# EasyEDA schematic schematics_easyEDA.json

## Sheets
1 BLOCK DIAGRAM: TITLE: BLOCK DIAGRAM; REV: 1.0; Date: 2023-02-03; Sheet: 1/7; Drawn By: hammad safeer; Company: FERN (BMS)
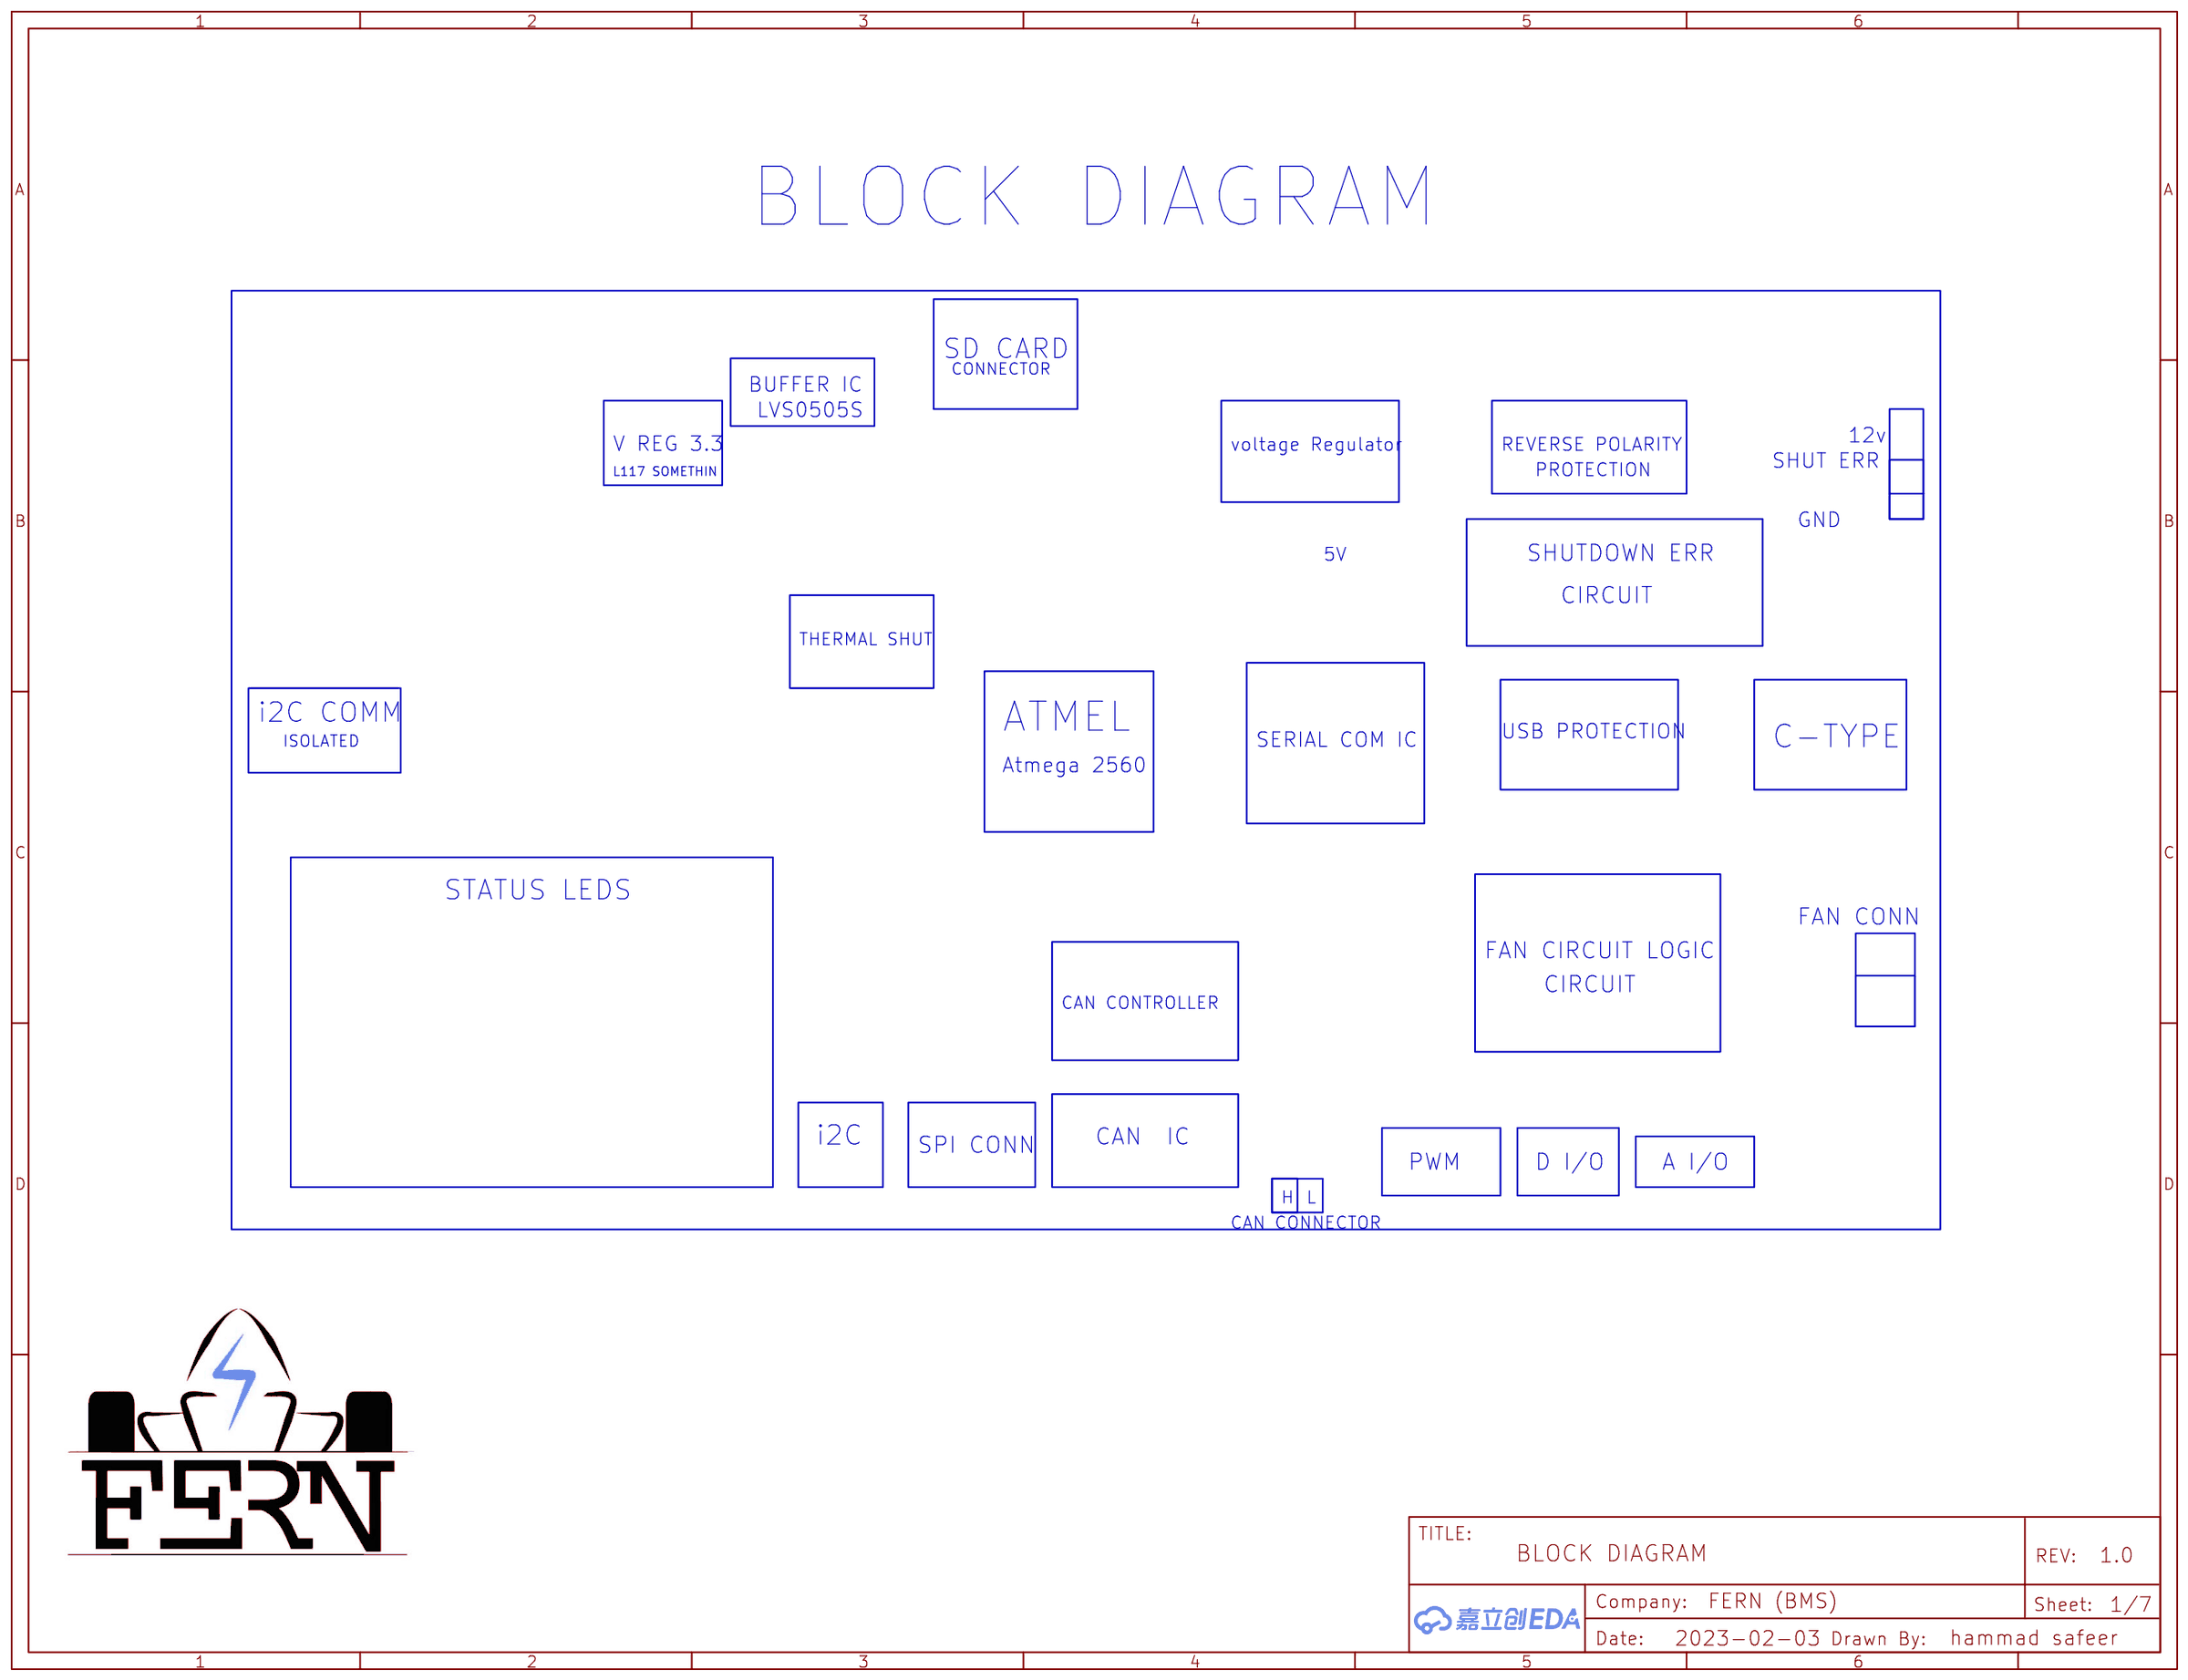
[diagram p0: BLOCK DIAGRAM]
2 main microcontroler: TITLE: atmega2560 section + CONENCTORS; Company: FERN BMS MASTER
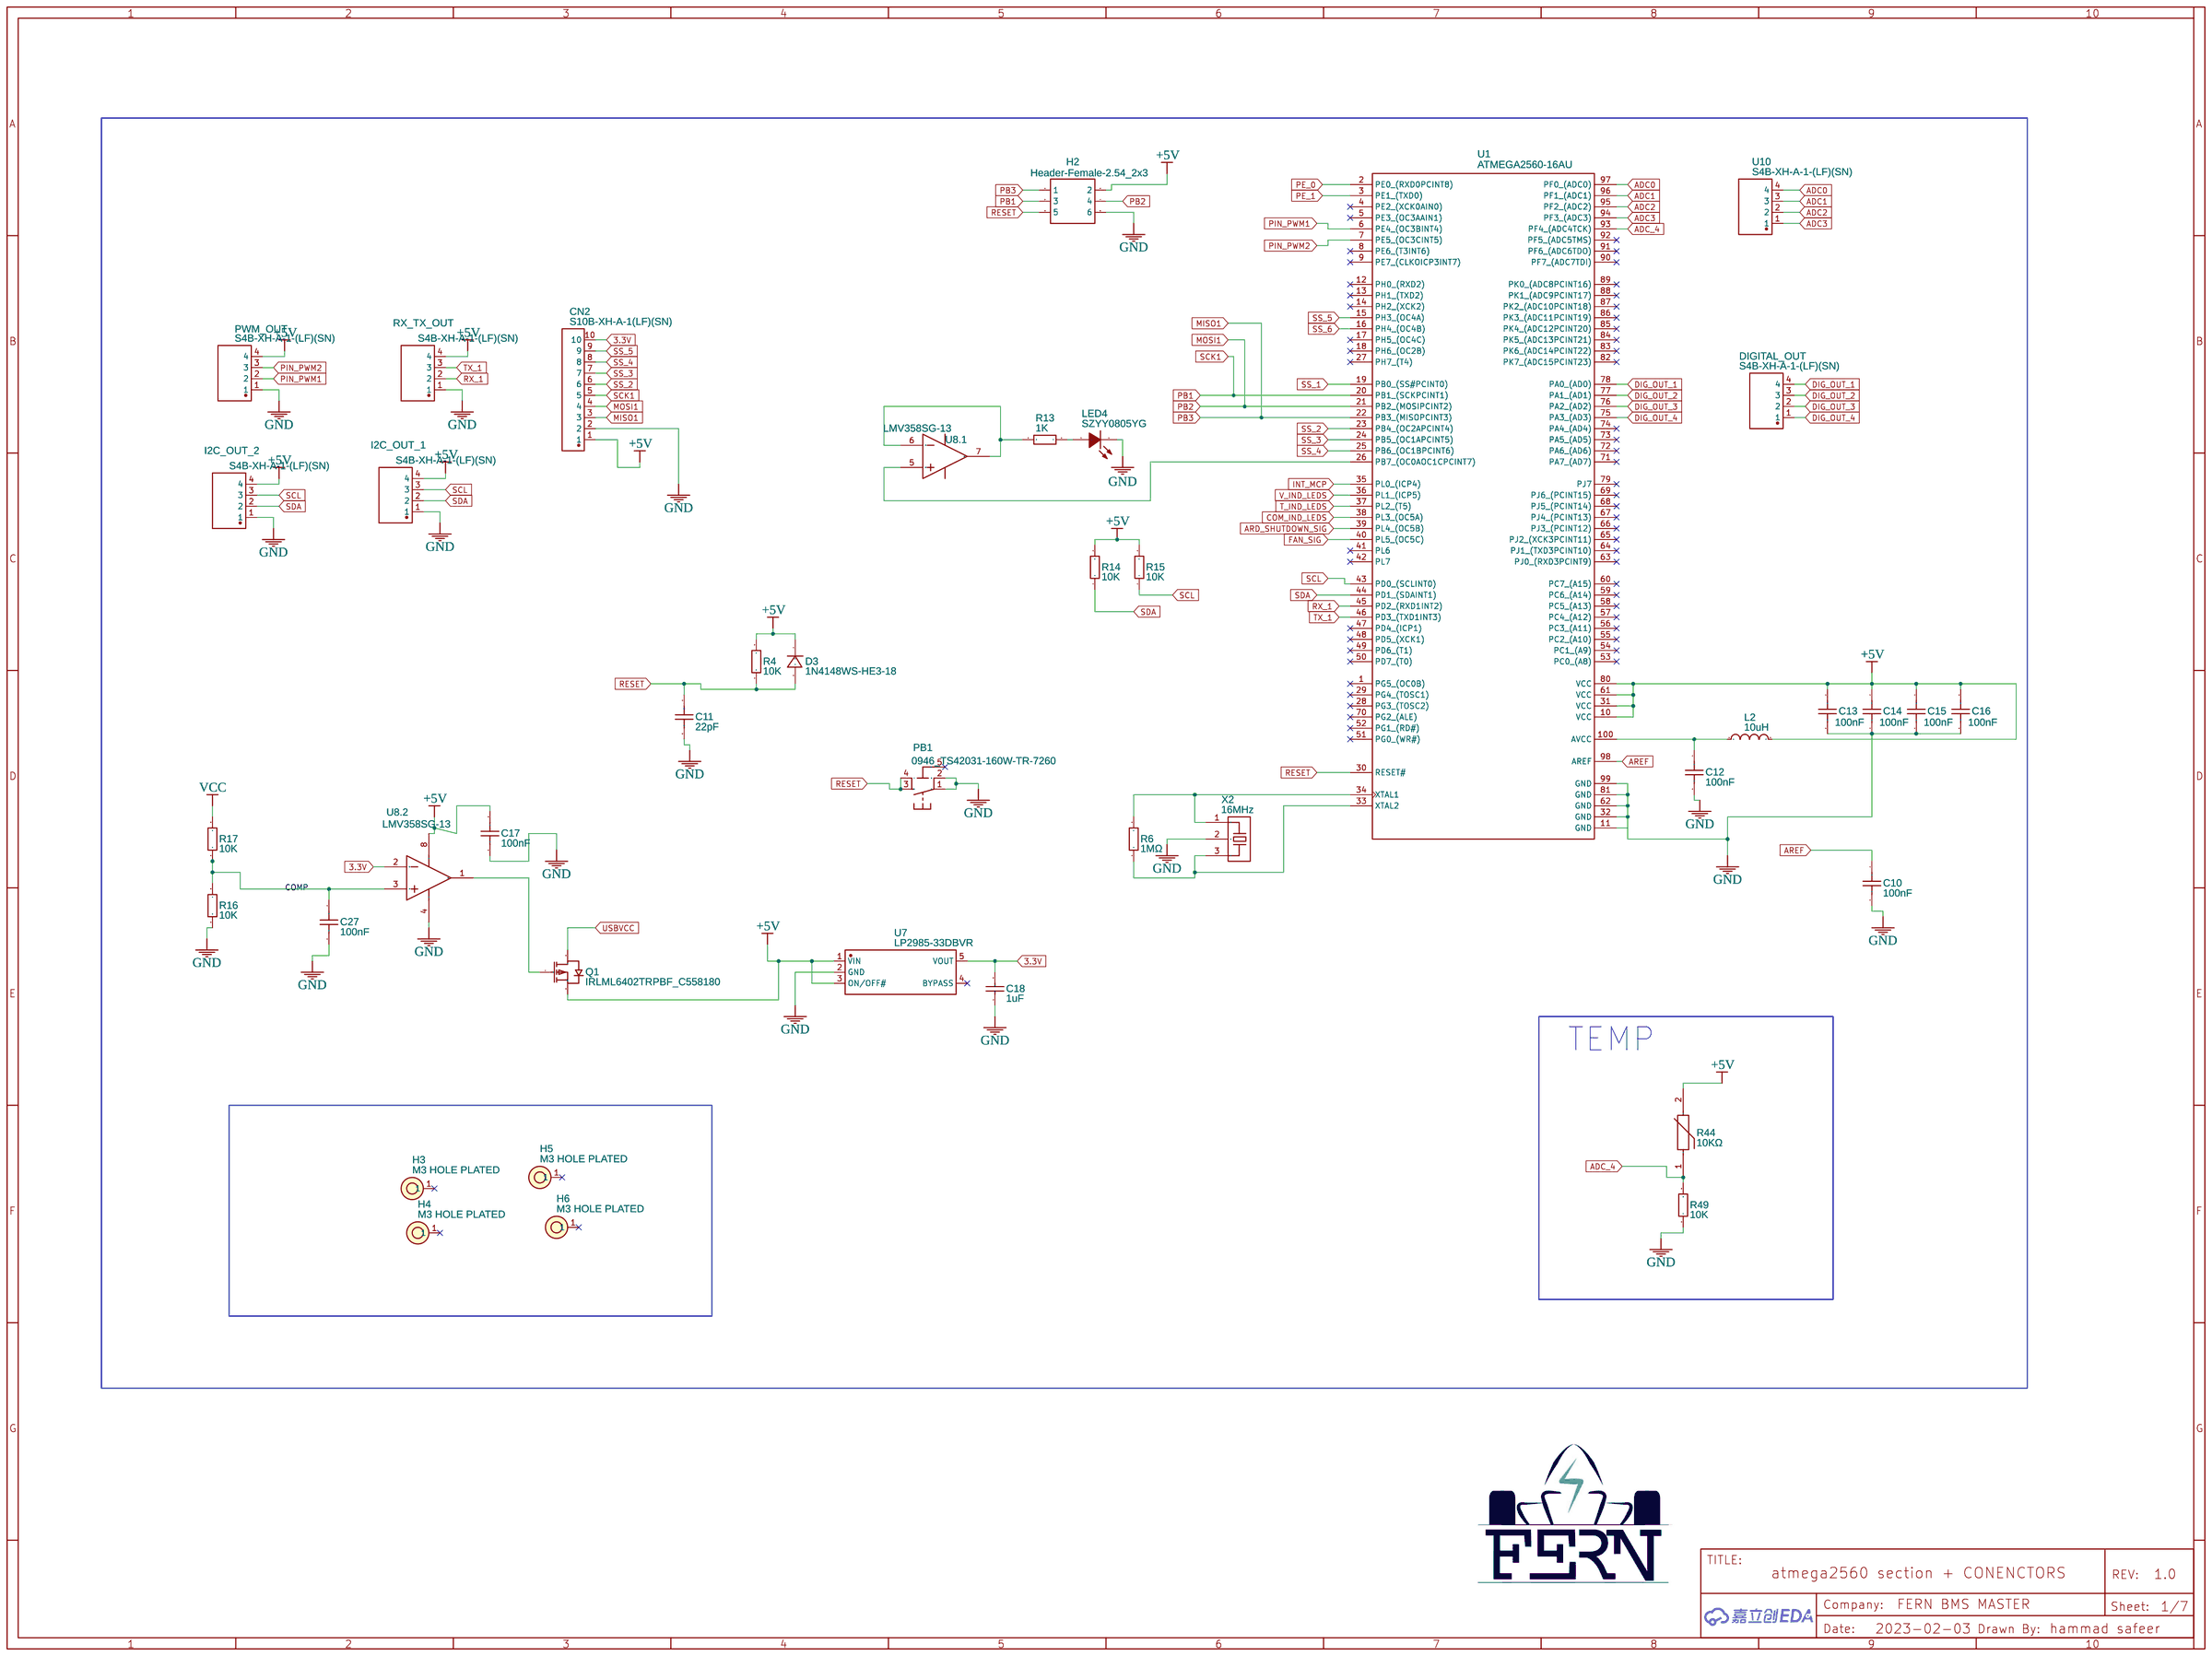
[diagram p1: main microcontroler]
3 programing uMicrocontroller: TITLE: PROGRAMMING microcontroller
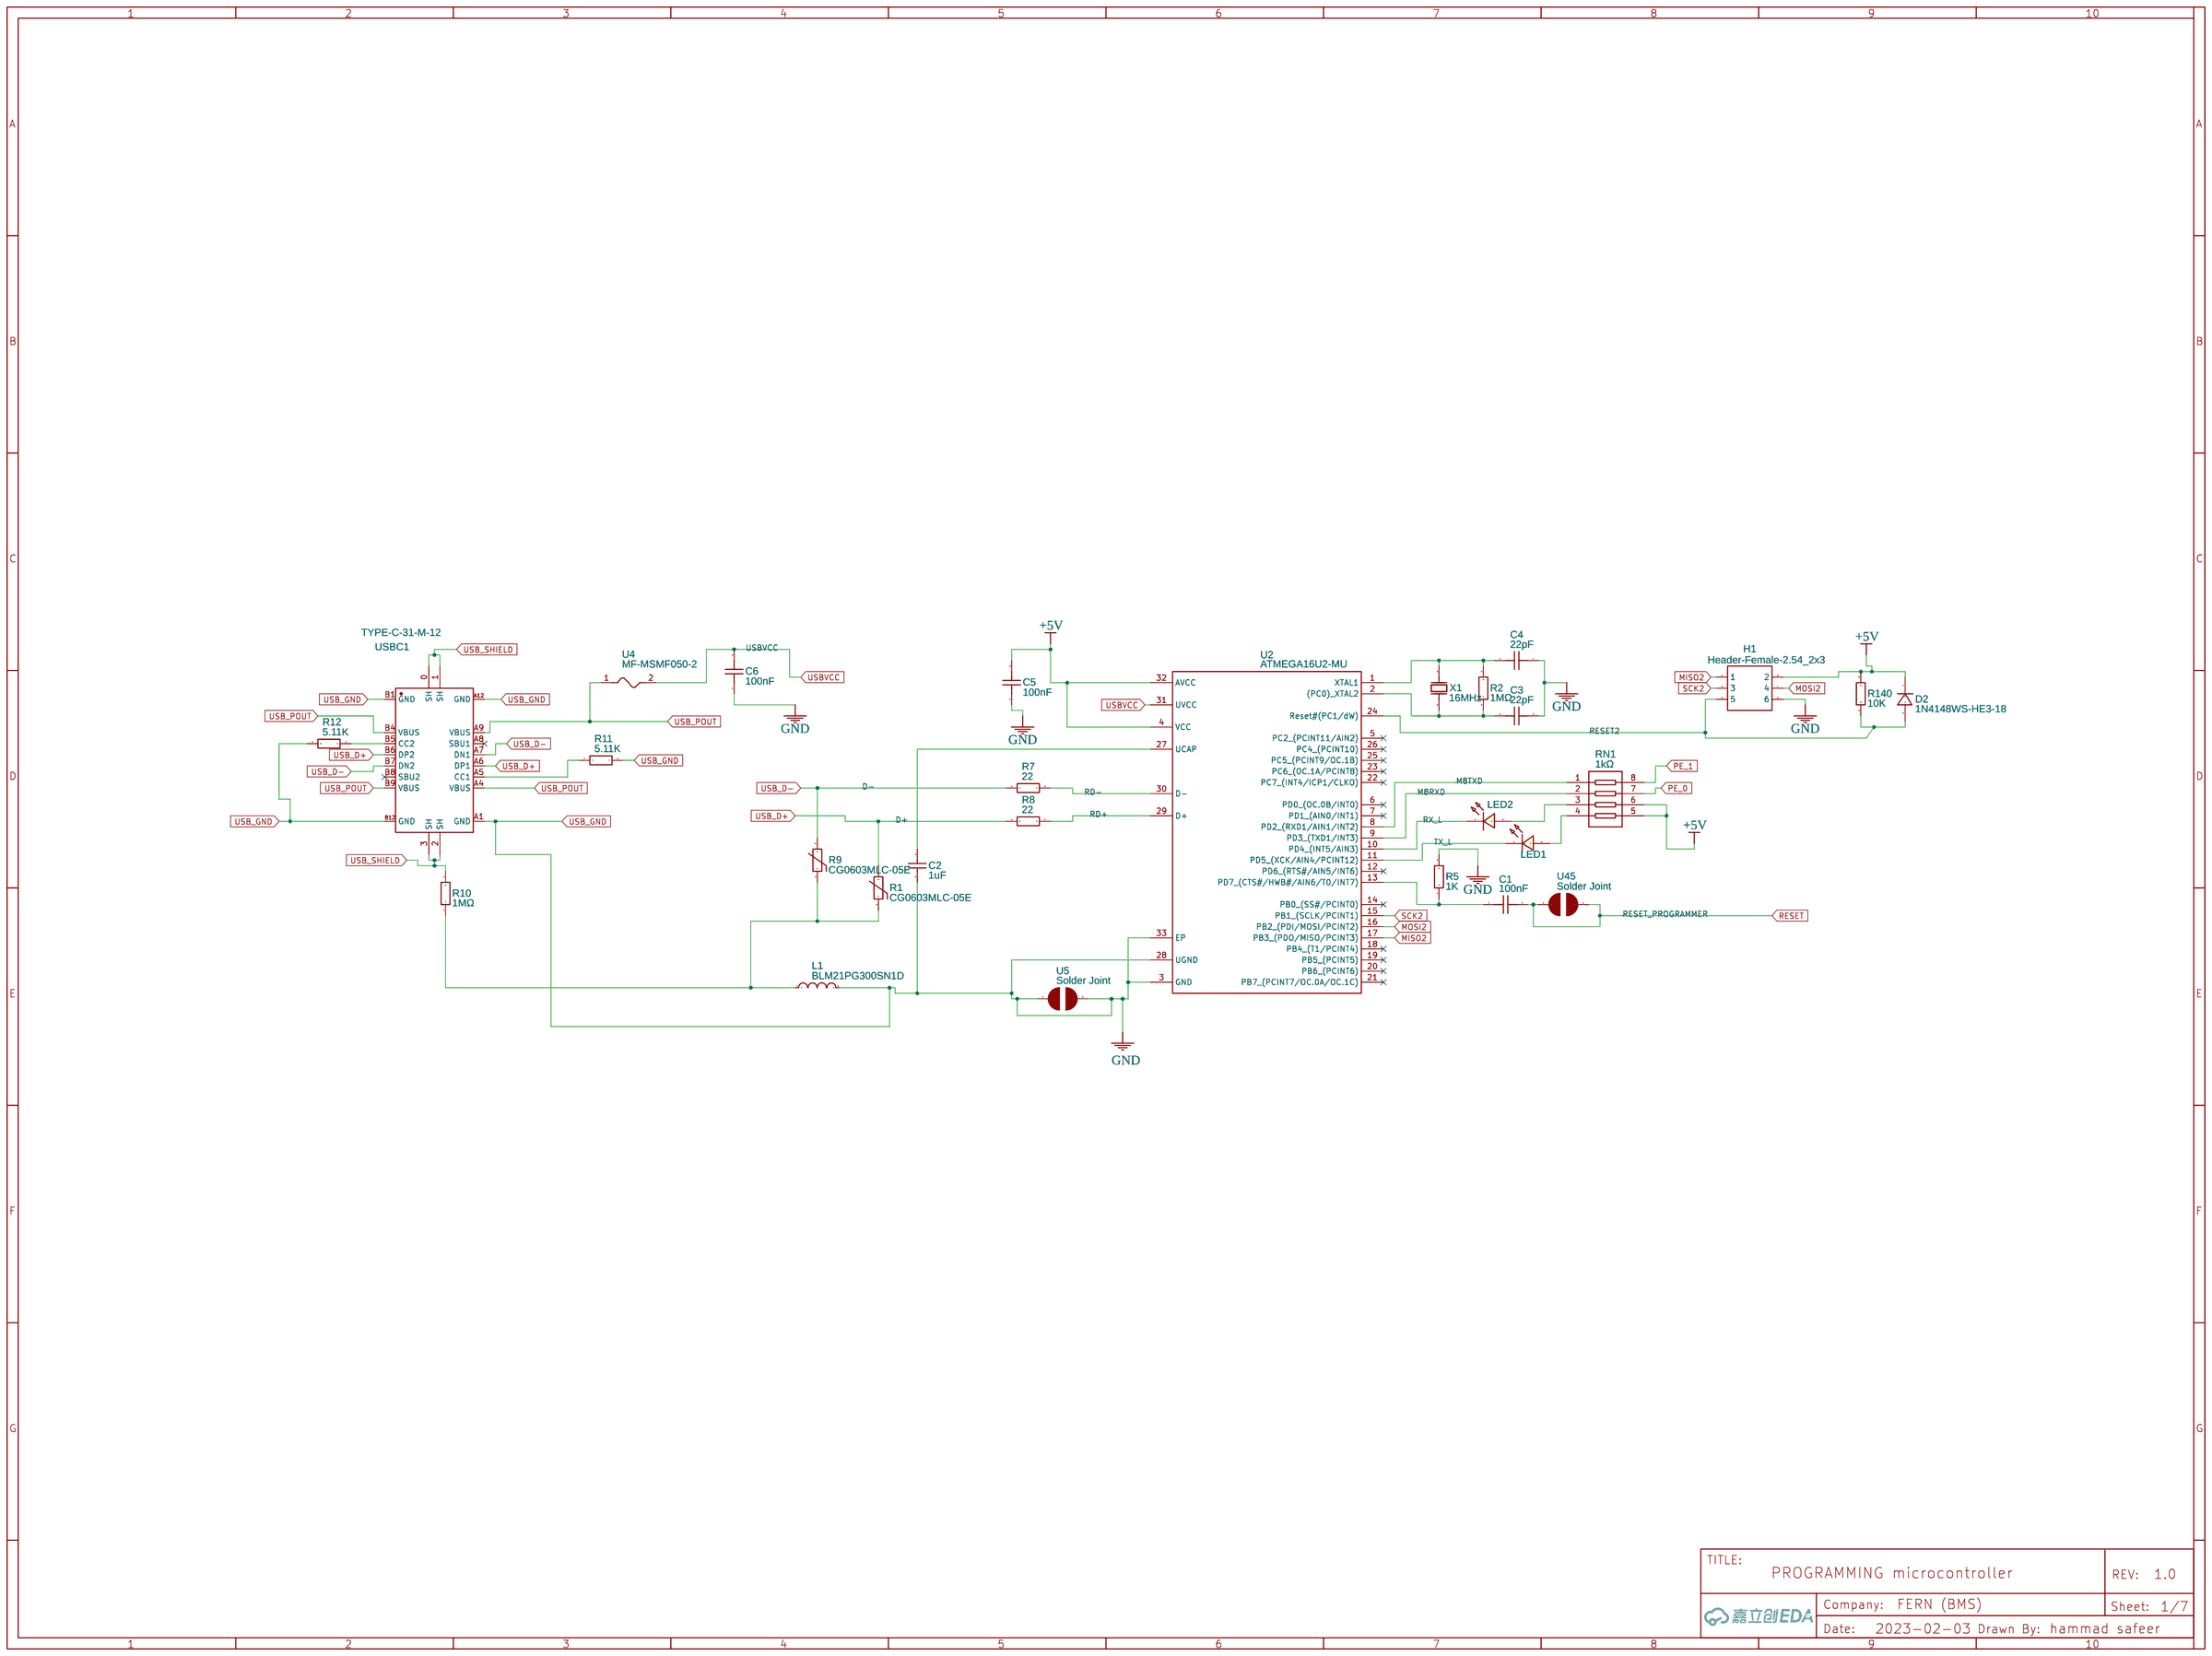
[diagram p2: programing uMicrocontroller]
4 POWER_SECTION: TITLE: POWER SECTION; Date: 2023-02-04; Company: FERN ( BMS )
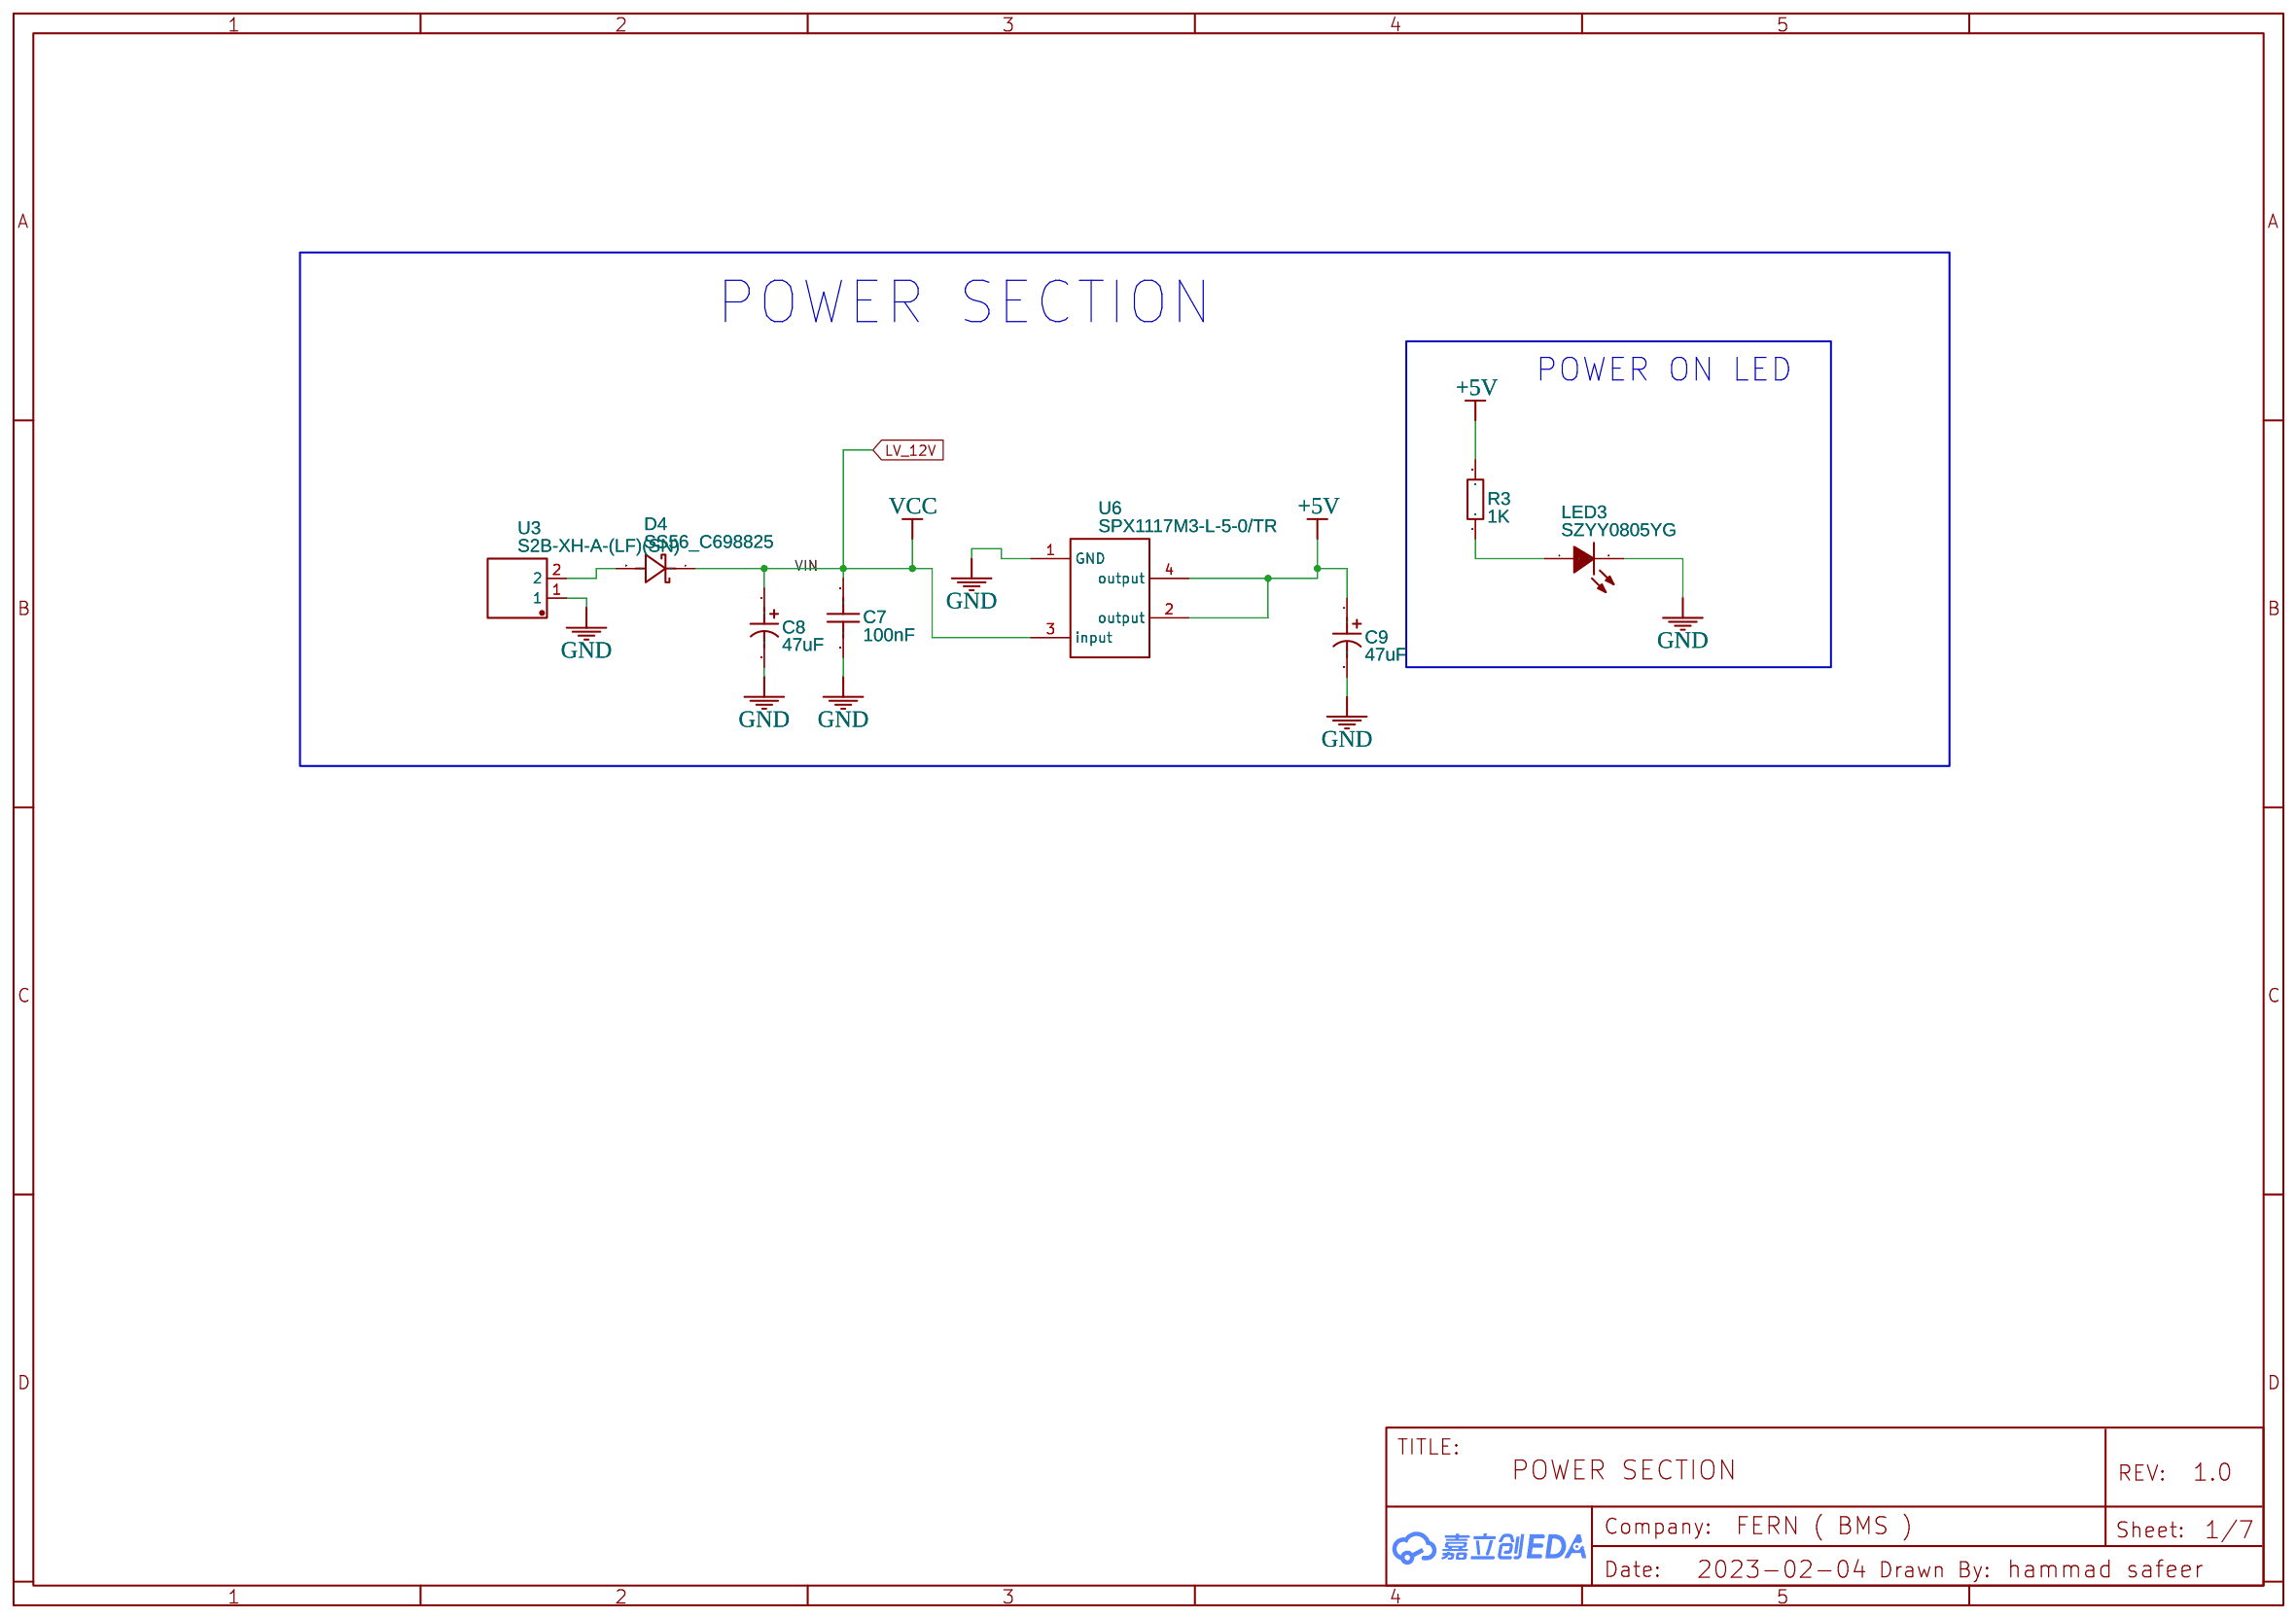
[diagram p3: POWER_SECTION]
5 LV SIGNAL SECTION: TITLE: LV SECTION; Date: 2023-02-07; Company: FERN( BMS )
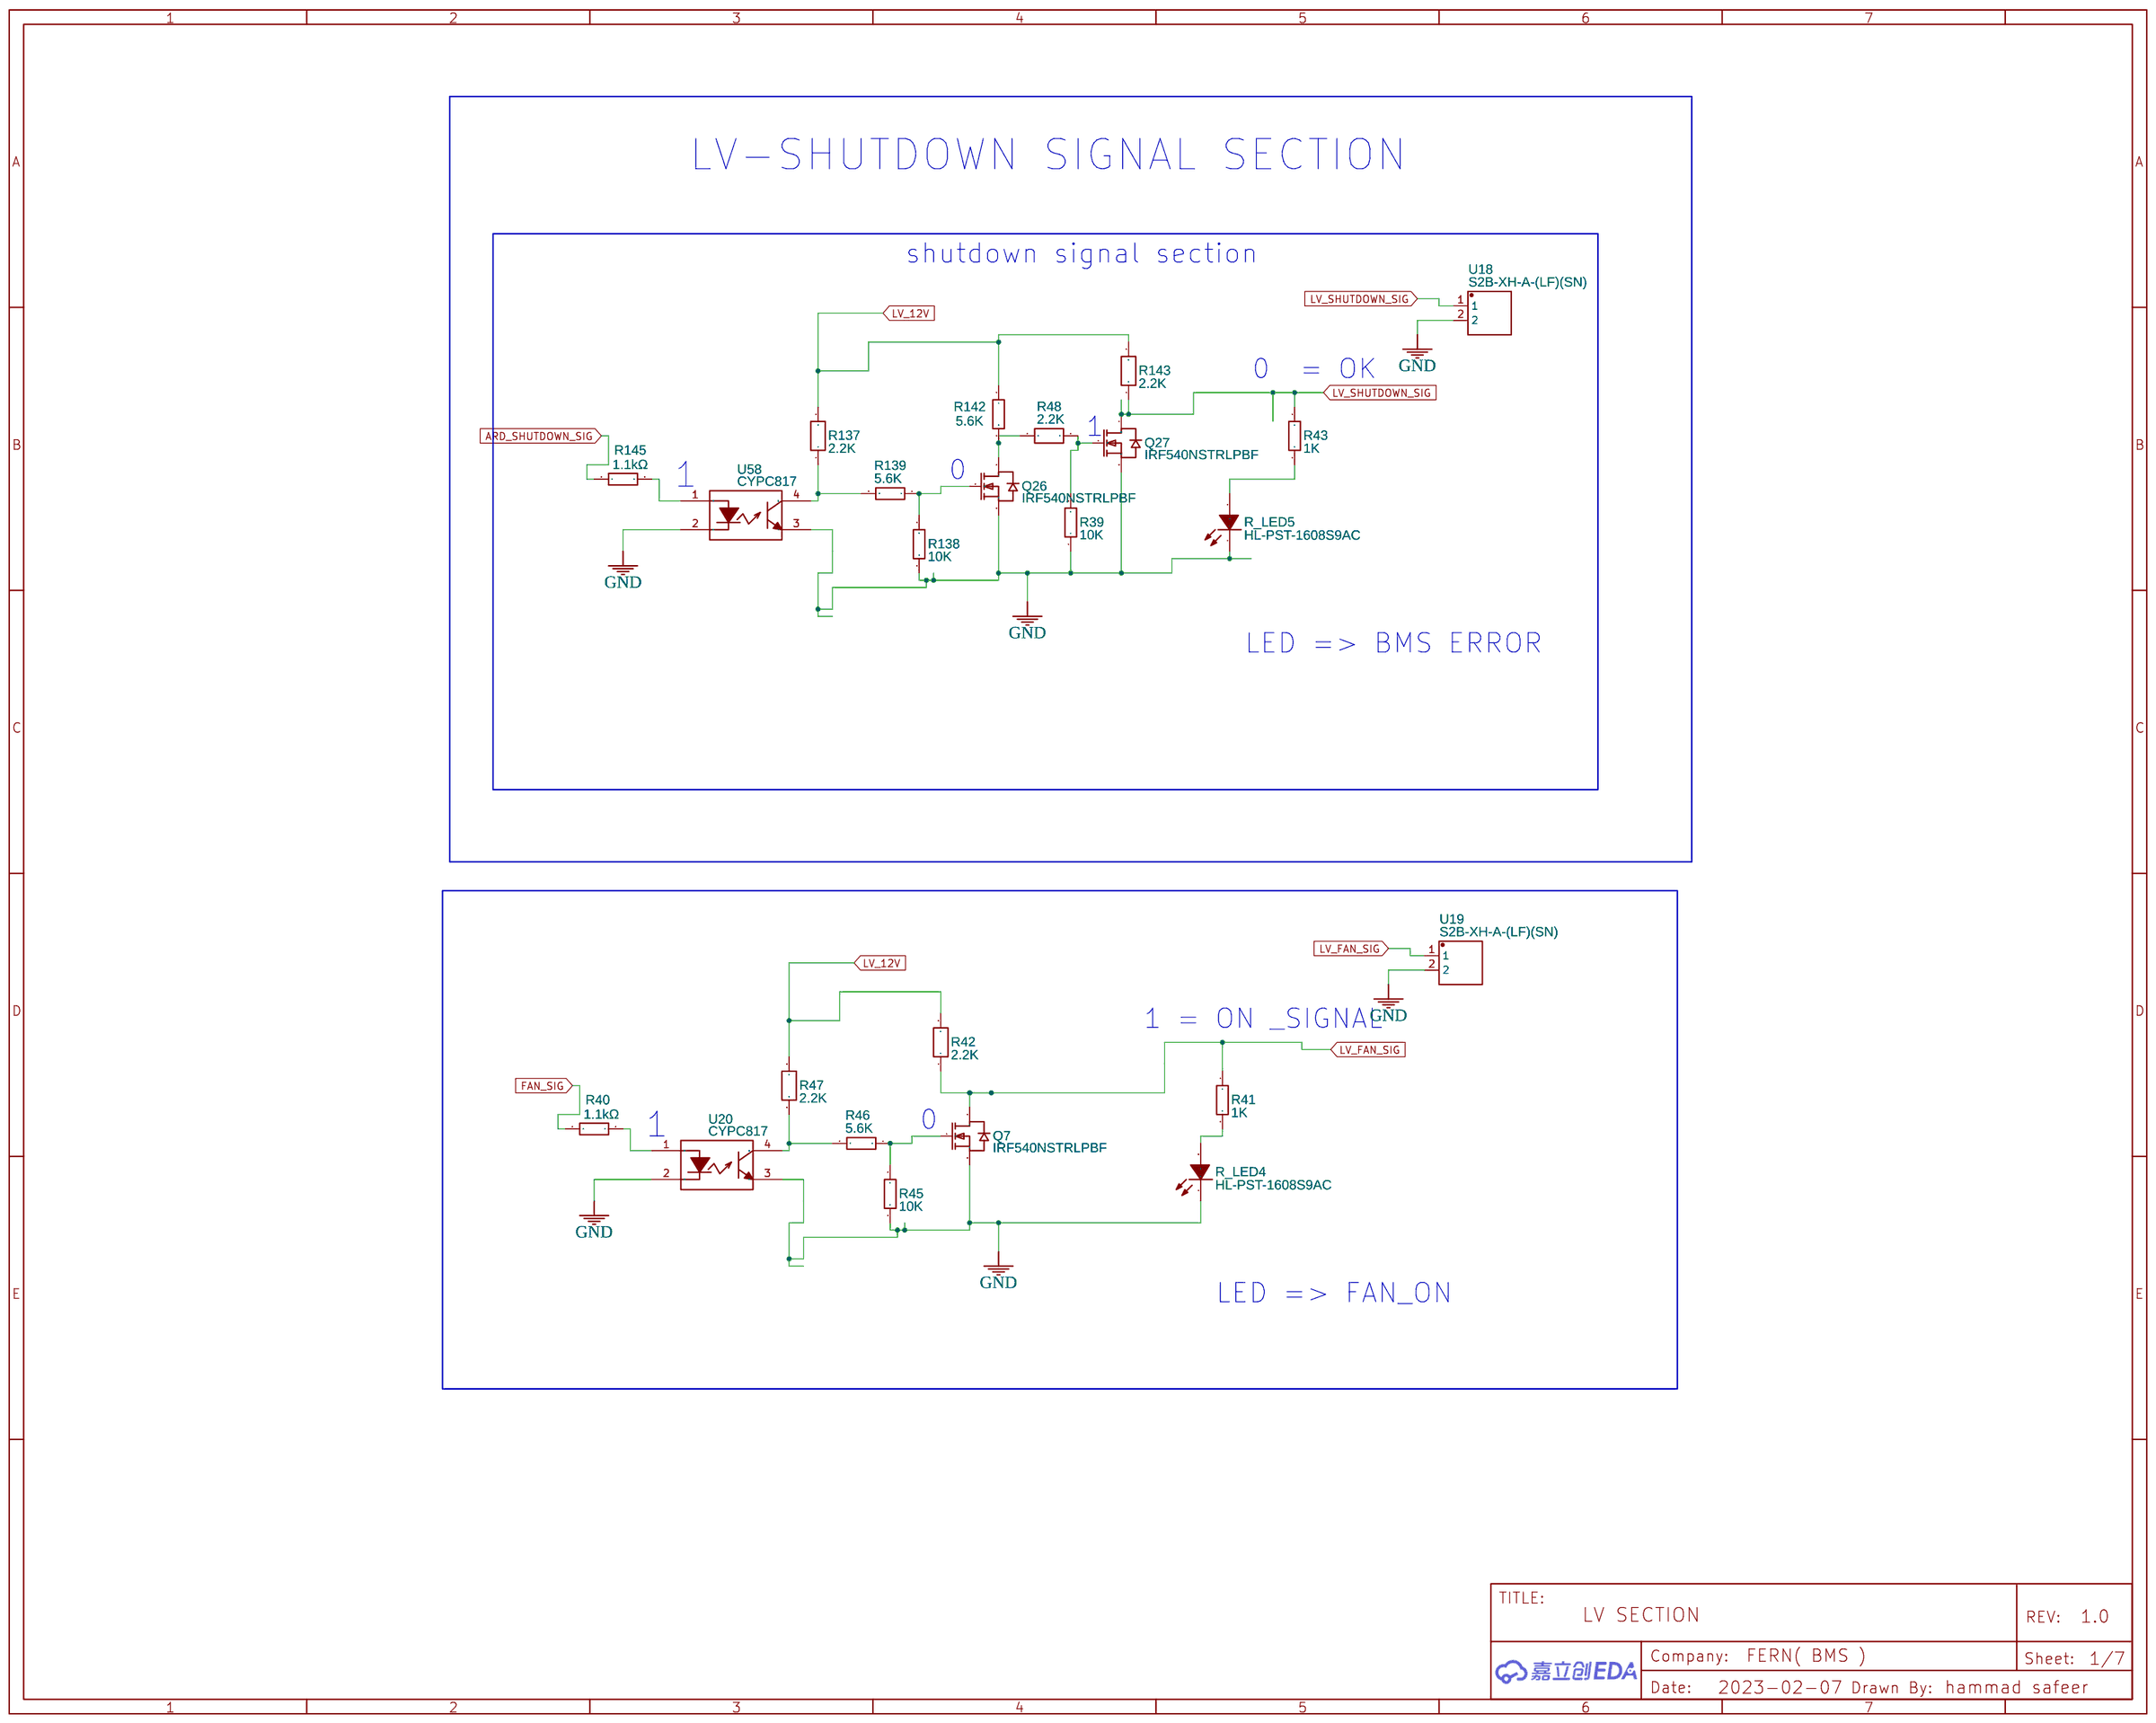
[diagram p4: LV SIGNAL SECTION]
6 LEDS_IND: TITLE: LED INDICATOR ( SECTION); Date: 2023-02-07; Company: FERN ( BMS )
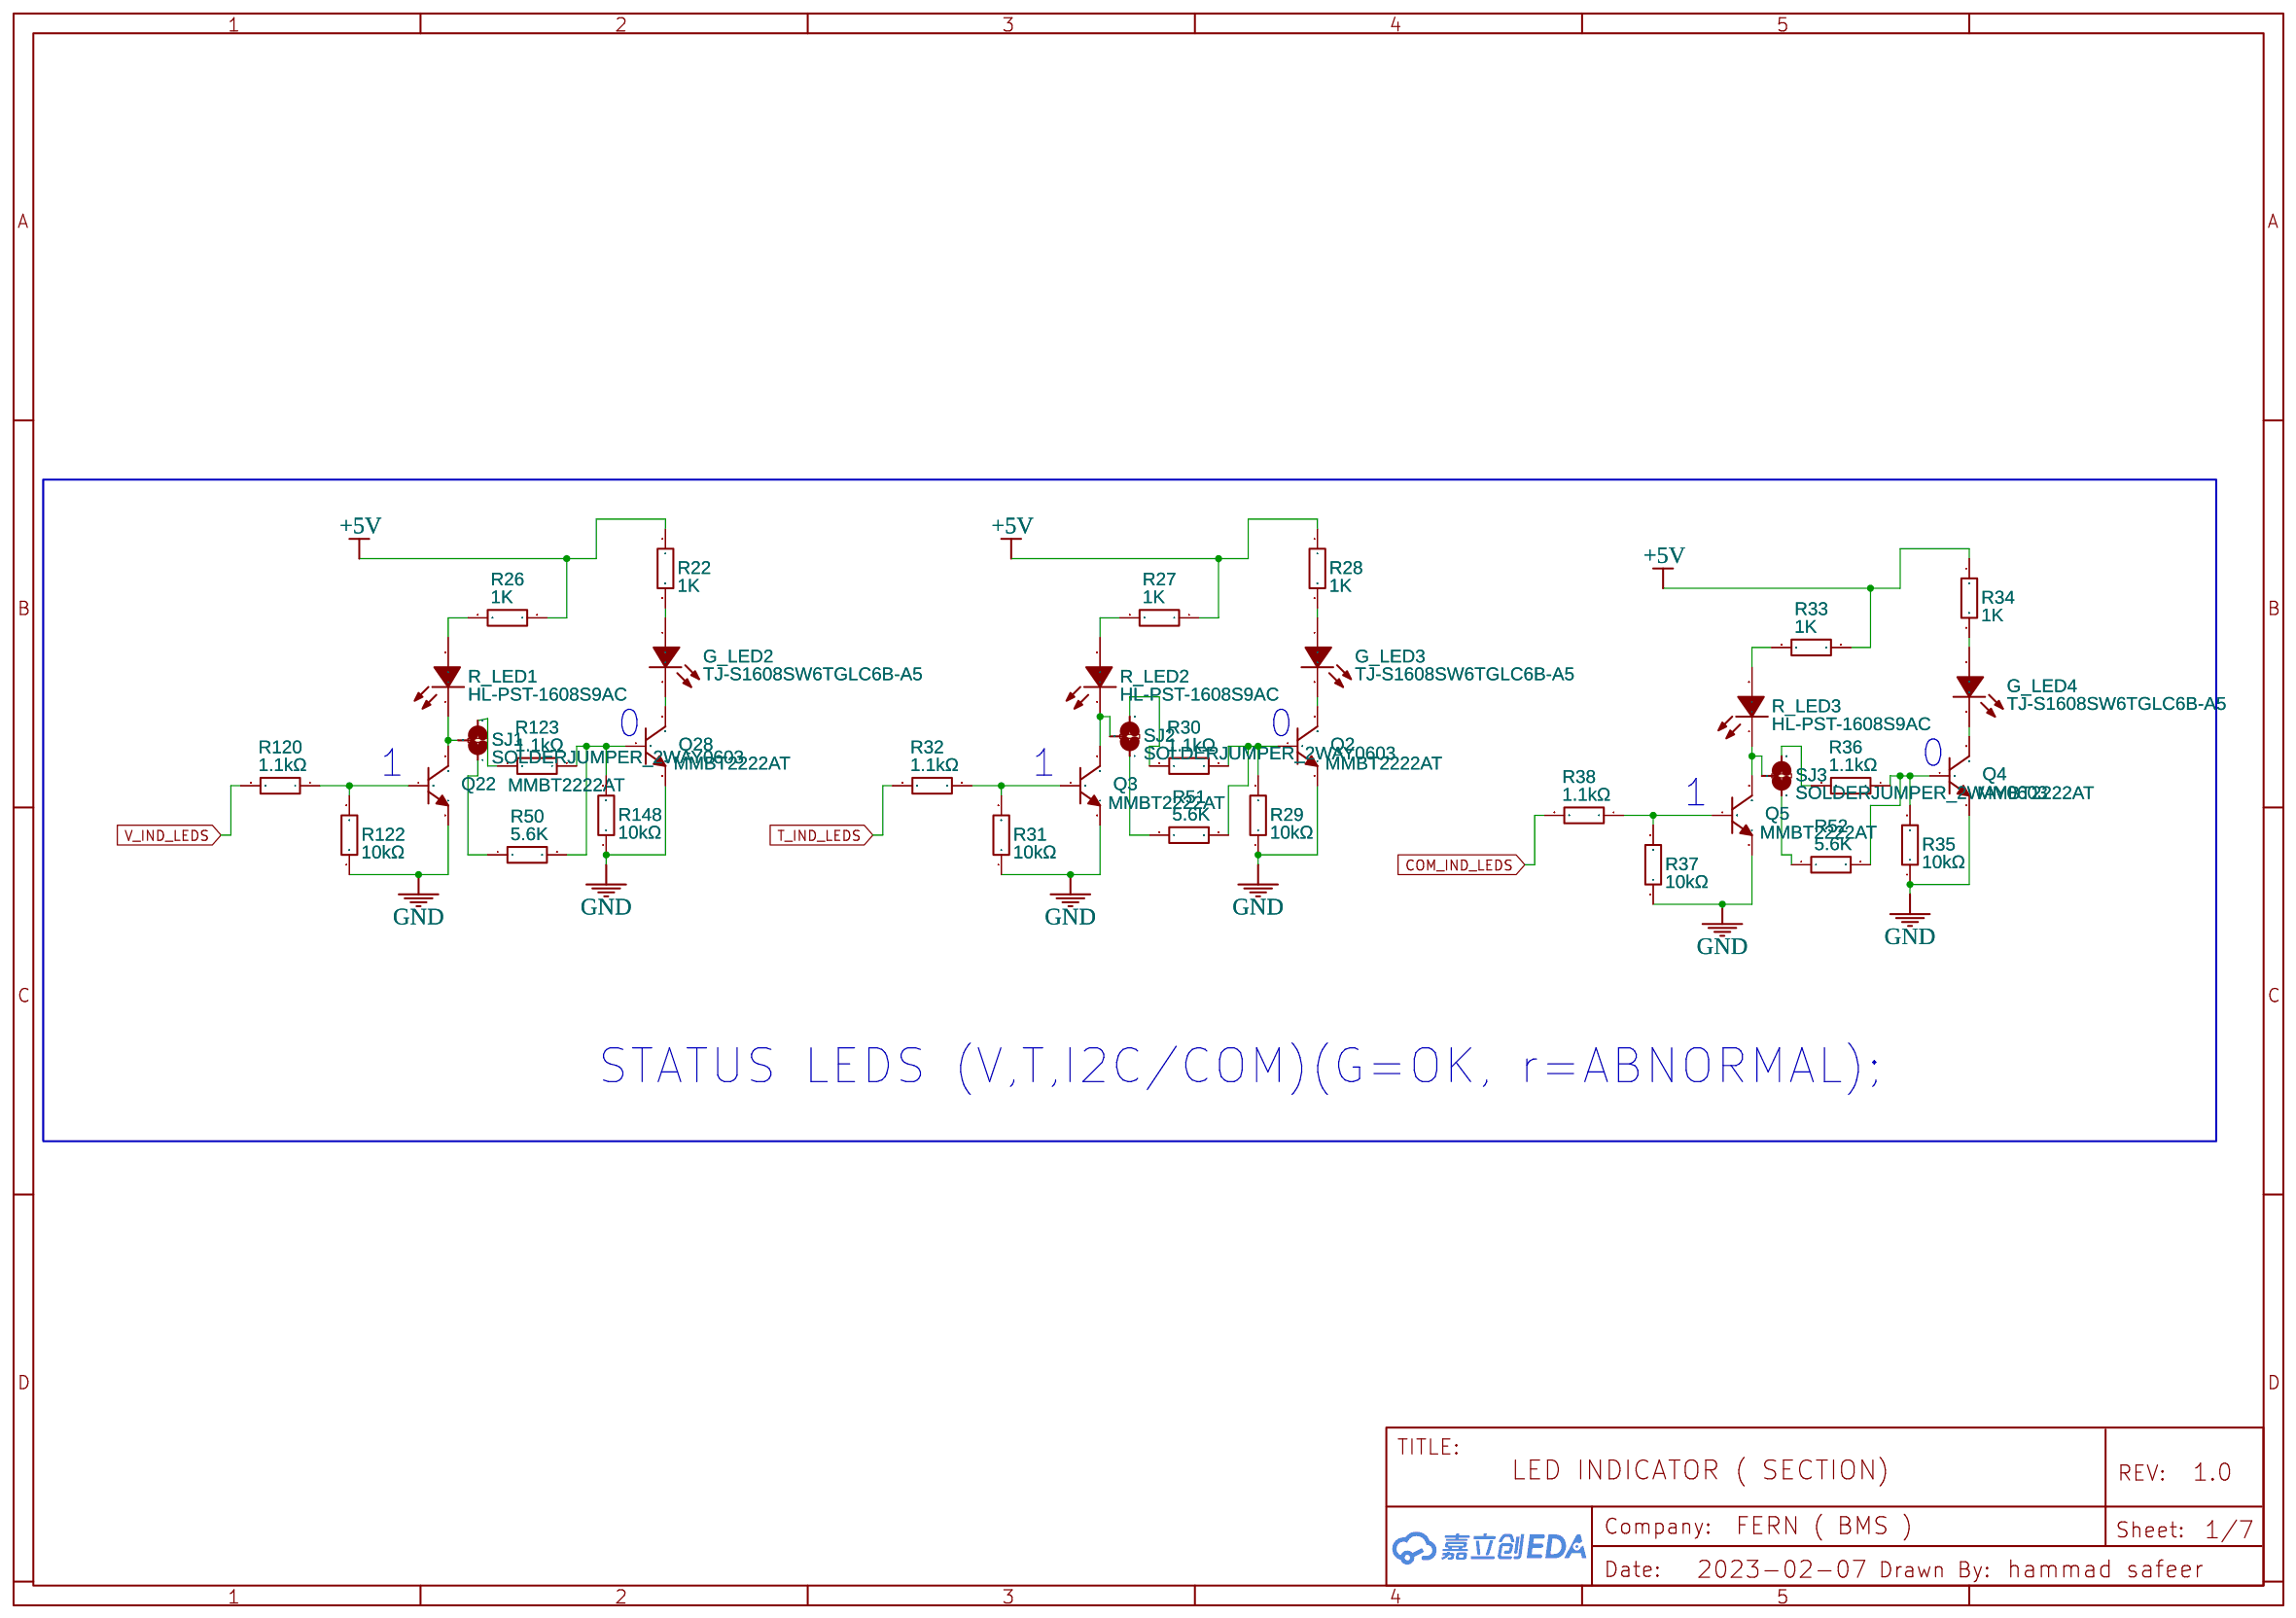
[diagram p5: LEDS_IND]
7 CAN SECTION: TITLE: CAN SECTION; Date: 2023-02-07; Company: FERN BMS
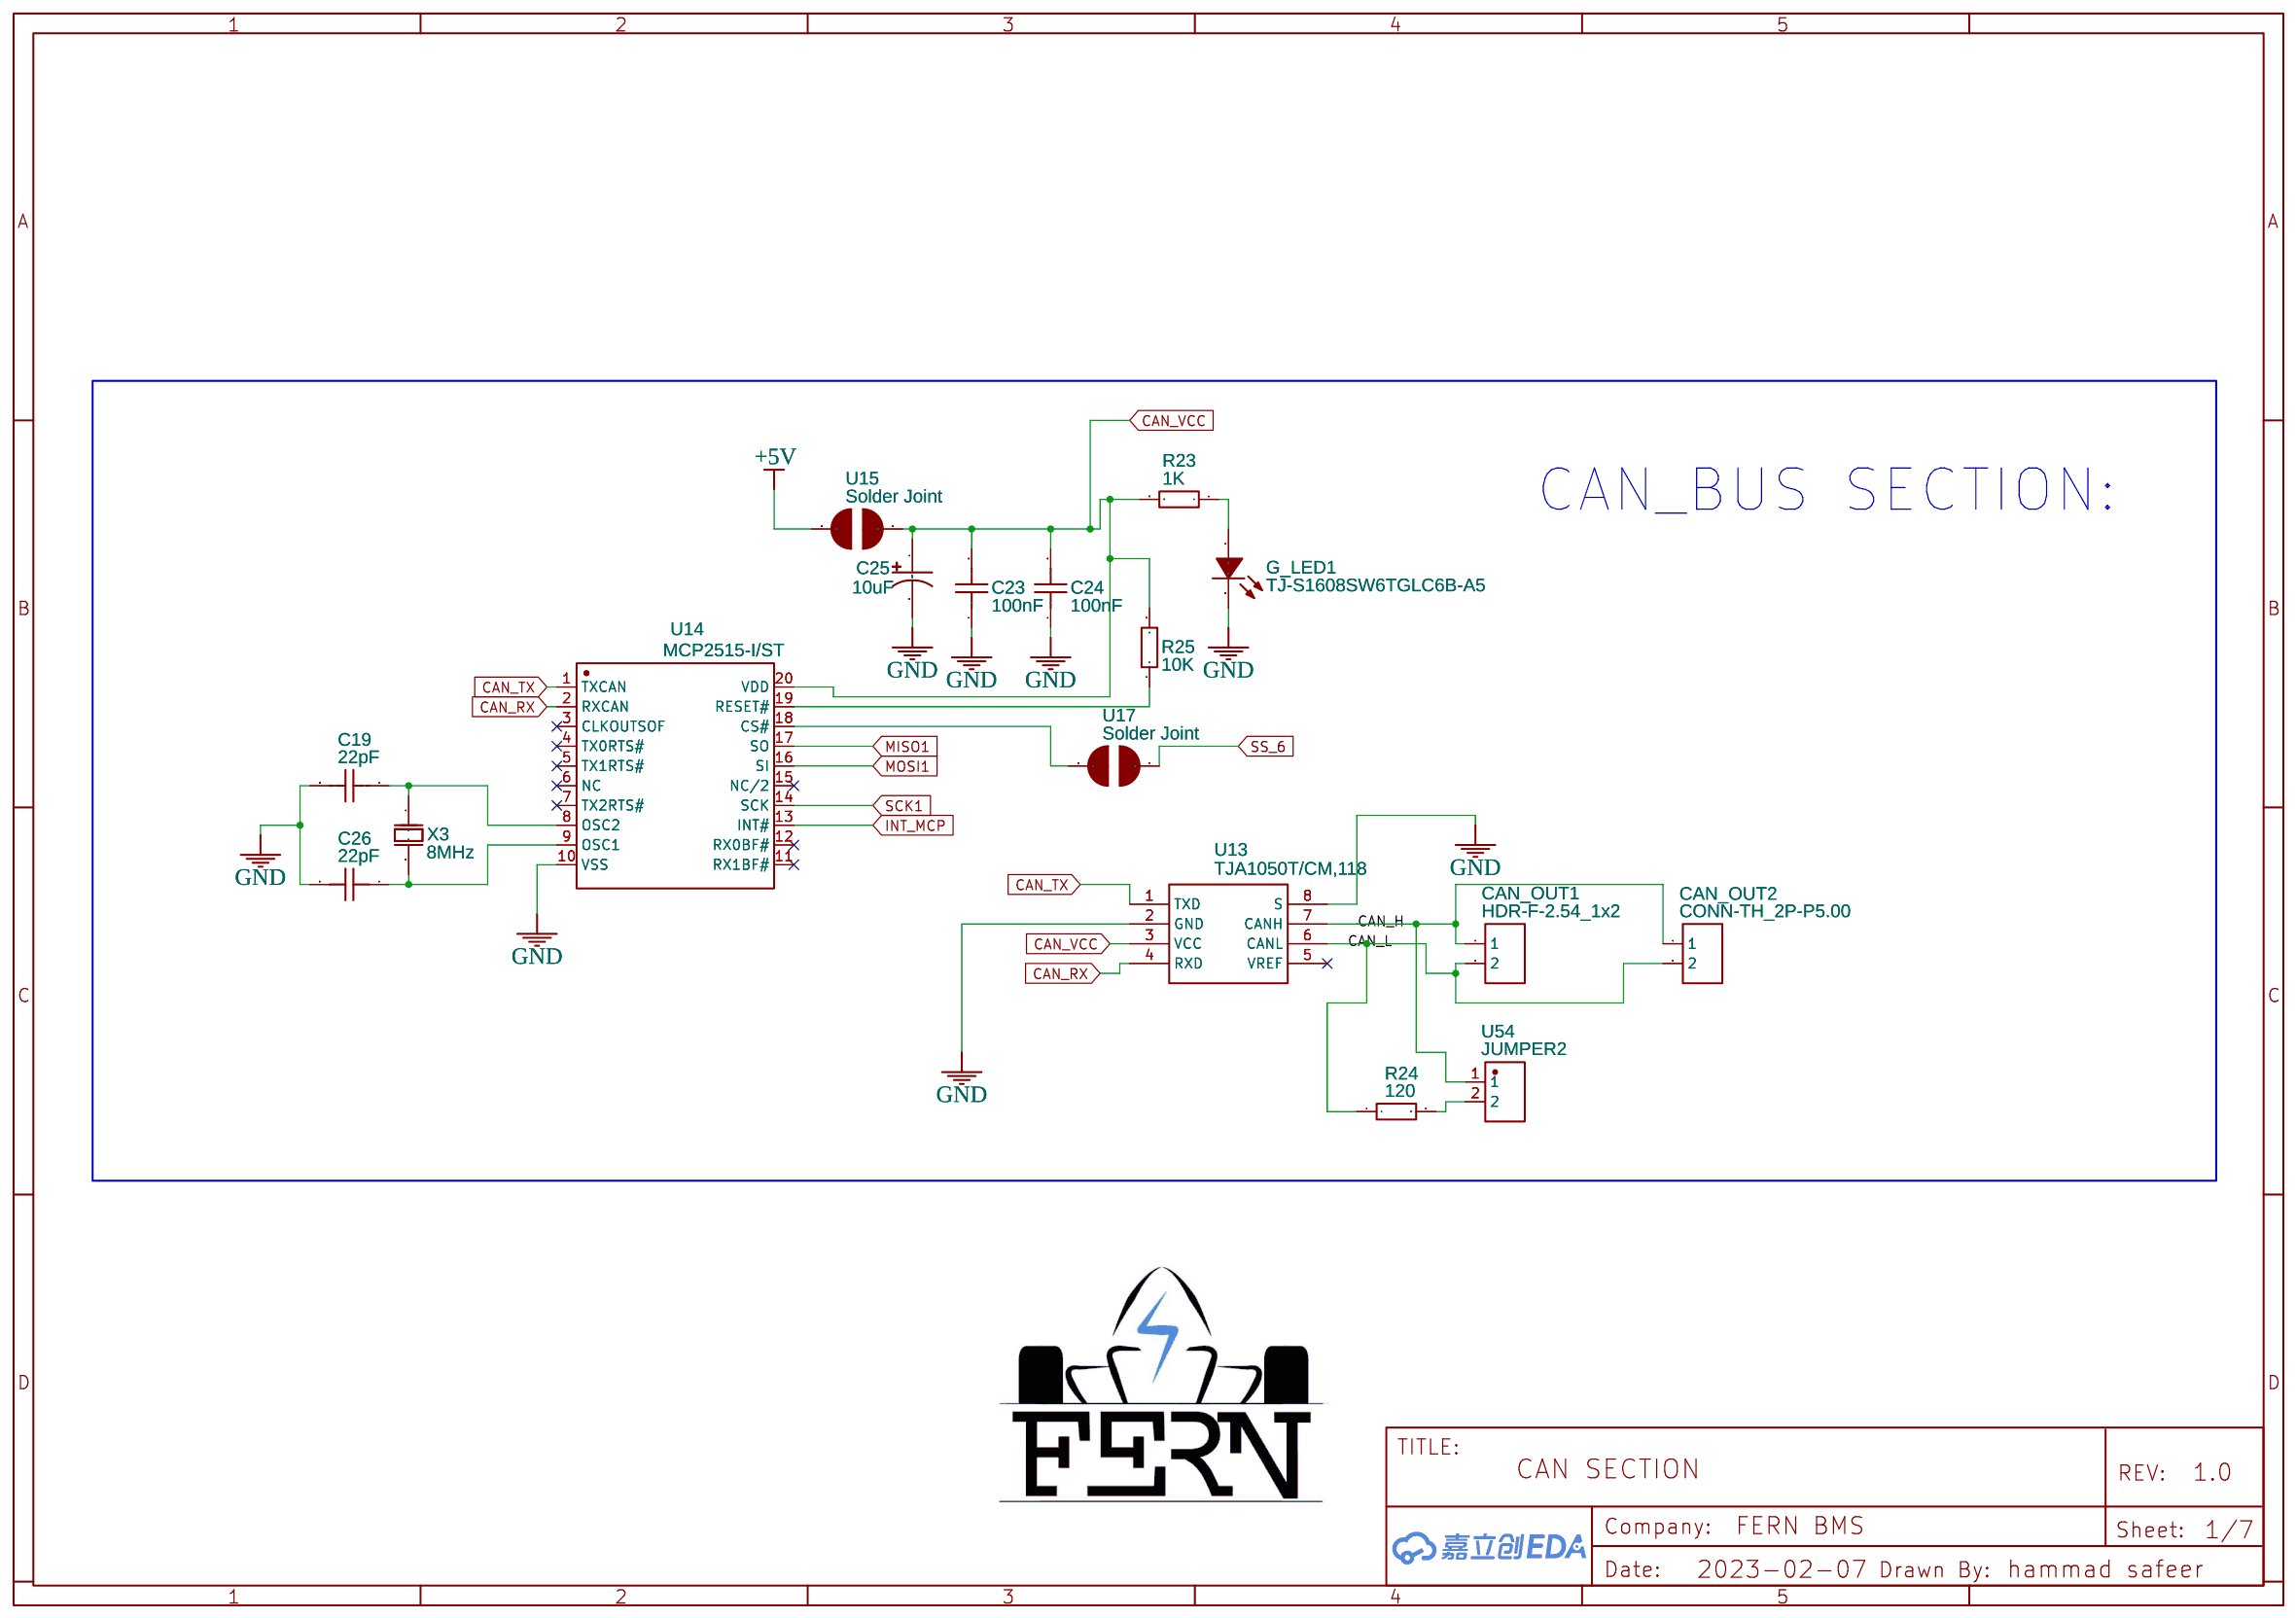
[diagram p6: CAN SECTION]
8 SDCARD_sECTION: TITLE: SD_CARD SECTION ( DATALOGING PART); Date: 2023-02-07; Company: FERN BMS
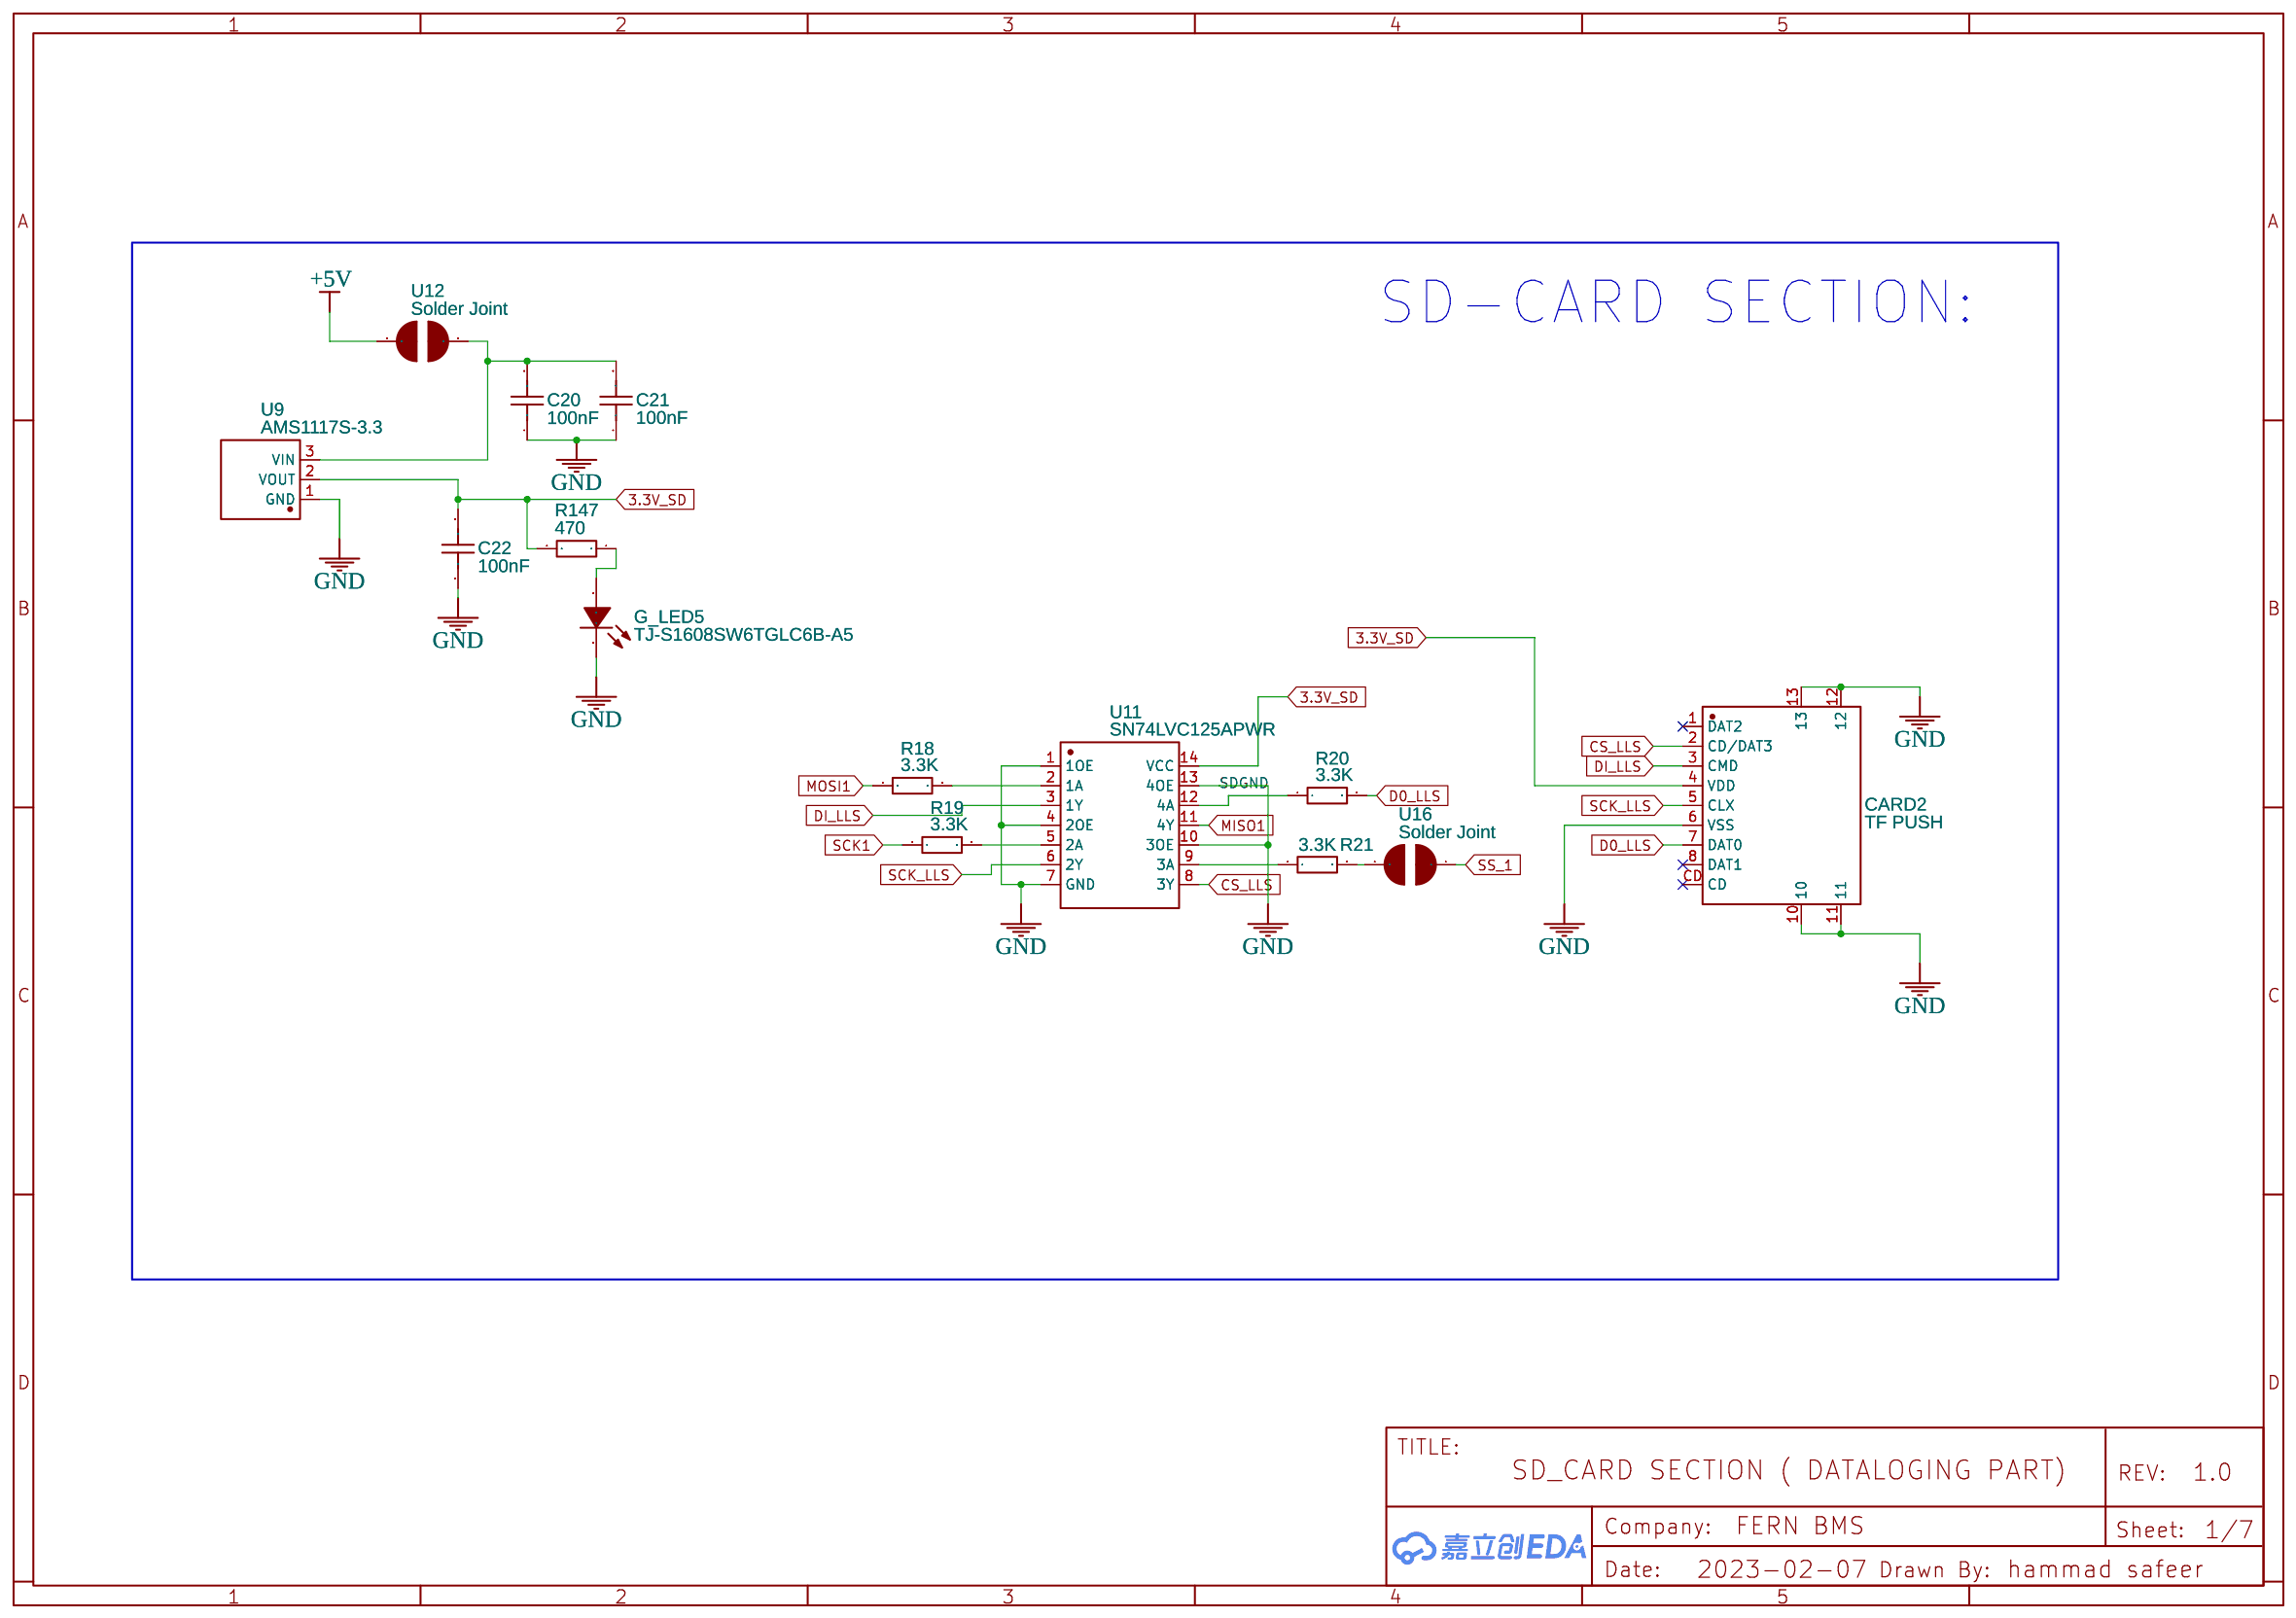
[diagram p7: SDCARD_sECTION]

## Parts
sheet CAN SECTION
C19  22pF  [C0603]
C23  100nF  [C0603]
C24  100nF  [C0603]
C25  10uF  [CASE-A_3216]
C26  22pF  [C0603]
CAN_OUT1  HDR-F-2.54_1x2  [HDR-F-2.54_1X2]
CAN_OUT2  CONN-TH_2P-P5.00  [CONN-TH_2P-P5.00]
G_LED1  TJ-S1608SW6TGLC6B-A5  [LED0603-R-RD_BLUE]
R23  1K  [R0603]
R24  120  [R0603]
R25  10K  [R0603]
U13  TJA1050T/CM,118  [SOIC-8_L5.0-W4.0-P1.27-LS6.0-BL]
U14  MCP2515-I/ST  [TSSOP-20_L6.5-W4.4-P0.65-LS6.4-BL]
U15  Solder Joint  [SOLDER-JOINT]
U17  Solder Joint  [SOLDER-JOINT]
U54  JUMPER2  [HDR-TH_2P-P2.54-V-M-1]
X3  8MHz  [HC-49US_L11.5-W4.5-P4.88]
sheet LEDS_IND
G_LED2  TJ-S1608SW6TGLC6B-A5  [LED0603-R-RD_BLUE]
G_LED3  TJ-S1608SW6TGLC6B-A5  [LED0603-R-RD_BLUE]
G_LED4  TJ-S1608SW6TGLC6B-A5  [LED0603-R-RD_BLUE]
Q2  MMBT2222AT  [SOT-523_L1.6-W0.8-P1.00-BR]
Q3  MMBT2222AT  [SOT-523_L1.6-W0.8-P1.00-BR]
Q4  MMBT2222AT  [SOT-523_L1.6-W0.8-P1.00-BR]
Q5  MMBT2222AT  [SOT-523_L1.6-W0.8-P1.00-BR]
Q22  MMBT2222AT  [SOT-523_L1.6-W0.8-P1.00-BR]
Q28  MMBT2222AT  [SOT-523_L1.6-W0.8-P1.00-BR]
R22  1K  [R0603]
R26  1K  [R0603]
R27  1K  [R0603]
R28  1K  [R0603]
R29  10kΩ  [R0603]
R30  1.1kΩ  [R0402]
R31  10kΩ  [R0603]
R32  1.1kΩ  [R0402]
R33  1K  [R0603]
R34  1K  [R0603]
R35  10kΩ  [R0603]
R36  1.1kΩ  [R0402]
R37  10kΩ  [R0603]
R38  1.1kΩ  [R0402]
R50  5.6K  [R0603]
R51  5.6K  [R0603]
R52  5.6K  [R0603]
R120  1.1kΩ  [R0402]
R122  10kΩ  [R0603]
R123  1.1kΩ  [R0402]
R148  10kΩ  [R0603]
R_LED1  HL-PST-1608S9AC  [LED0603-RD_RED]
R_LED2  HL-PST-1608S9AC  [LED0603-RD_RED]
R_LED3  HL-PST-1608S9AC  [LED0603-RD_RED]
SJ1  SOLDERJUMPER_2WAY0603  [SOLDERJUMPER_2WAY_OPEN_0603]
SJ2  SOLDERJUMPER_2WAY0603  [SOLDERJUMPER_2WAY_OPEN_0603]
SJ3  SOLDERJUMPER_2WAY0603  [SOLDERJUMPER_2WAY_OPEN_0603]
sheet LV SIGNAL SECTION
Q7  IRF540NSTRLPBF  [TO-263-2_L10.0-W9.1-P5.08-LS15.2-TL]
Q26  IRF540NSTRLPBF  [TO-263-2_L10.0-W9.1-P5.08-LS15.2-TL]
Q27  IRF540NSTRLPBF  [TO-263-2_L10.0-W9.1-P5.08-LS15.2-TL]
R39  10K  [R0603]
R40  1.1kΩ  [R0402]
R41  1K  [R0603]
R42  2.2K  [R1206]
R43  1K  [R0603]
R45  10K  [R0603]
R46  5.6K  [R0603]
R47  2.2K  [R1206]
R48  2.2K  [R1206]
R137  2.2K  [R1206]
R138  10K  [R0603]
R139  5.6K  [R0603]
R142  5.6K  [R0603]
R143  2.2K  [R1206]
R145  1.1kΩ  [R0402]
R_LED4  HL-PST-1608S9AC  [LED0603-RD_RED]
R_LED5  HL-PST-1608S9AC  [LED0603-RD_RED]
U18  S2B-XH-A-(LF)(SN)  [CONN-TH_S2B-XH-A-LF-SN]
U19  S2B-XH-A-(LF)(SN)  [CONN-TH_S2B-XH-A-LF-SN]
U20  CYPC817  [DIP-4_L6.4-W4.6-P2.54-LS7.6-BL]
U58  CYPC817  [DIP-4_L6.4-W4.6-P2.54-LS7.6-BL]
sheet main microcontroler
C10  100nF  [C0603]
C11  22pF  [C0603]
C12  100nF  [C0603]
C13  100nF  [C0603]
C14  100nF  [C0603]
C15  100nF  [C0603]
C16  100nF  [C0603]
C17  100nF  [C0603]
C18  1uF  [C0603]
C27  100nF  [C0603]
CN2  S10B-XH-A-1(LF)(SN)  [CONN-TH_S10B-XH-A-1-LF-SN]
D3  1N4148WS-HE3-18  [SOD-323F_L2.0-W1.6-LS2.5-RD]
DIGITAL_OUT  S4B-XH-A-1-(LF)(SN)  [CONN-TH_4P-P2.50_S4B-XH-A-1-LF-SN]
H2  Header-Female-2.54_2x3  [HDR-TH_6P-P2.54-V-F-R2-C3-S2.54]
H3  M3 HOLE PLATED  [M3 HOLE PLATED]
H4  M3 HOLE PLATED  [M3 HOLE PLATED]
H5  M3 HOLE PLATED  [M3 HOLE PLATED]
H6  M3 HOLE PLATED  [M3 HOLE PLATED]
I2C_OUT_1  S4B-XH-A-1-(LF)(SN)  [CONN-TH_4P-P2.50_S4B-XH-A-1-LF-SN]
I2C_OUT_2  S4B-XH-A-1-(LF)(SN)  [CONN-TH_4P-P2.50_S4B-XH-A-1-LF-SN]
L2  10uH  [L0805]
LED4  SZYY0805YG  [LED0805-R-RD_GREEN]
PB1  0946_TS42031-160W-TR-7260  [TS42]
PWM_OUT  S4B-XH-A-1-(LF)(SN)  [CONN-TH_4P-P2.50_S4B-XH-A-1-LF-SN]
Q1  IRLML6402TRPBF_C558180  [SOT-23-3_L2.9-W1.6-P1.90-LS2.8-BR]
R4  10K  [R0603]
R6  1MΩ  [R0603]
R13  1K  [R0603]
R14  10K  [R0603]
R15  10K  [R0603]
R16  10K  [R0603]
R17  10K  [R0603]
R44  10KΩ  [R0603]
R49  10K  [R0603]
RX_TX_OUT  S4B-XH-A-1-(LF)(SN)  [CONN-TH_4P-P2.50_S4B-XH-A-1-LF-SN]
U1  ATMEGA2560-16AU  [TQFP-100_L14.0-W14.0-P0.50-LS16.0-BL]
U7  LP2985-33DBVR  [SOT-23-5_L2.9-W1.6-P0.95-LS2.8-TL]
U8  LMV358SG-13  [SOIC-8_L4.9-W3.9-P1.27-LS6.0-BL]  (sections 1,2)
U10  S4B-XH-A-1-(LF)(SN)  [CONN-TH_4P-P2.50_S4B-XH-A-1-LF-SN]
X2  16MHz  [OSC-SMD_3P-L3.2-W1.3-P0.95-L]
sheet POWER_SECTION
C7  100nF  [C0603]
C8  47uF  [CAP-SMD_BD6.3-L6.6-W6.6-LS7.2-FD]
C9  47uF  [CAP-SMD_BD6.3-L6.6-W6.6-LS7.2-FD]
D4  SS56_C698825  [SMC_L6.9-W5.9-LS7.9-RD]
LED3  SZYY0805YG  [LED0805-R-RD_GREEN]
R3  1K  [R0603]
U3  S2B-XH-A-(LF)(SN)  [CONN-TH_S2B-XH-A-LF-SN]
U6  SPX1117M3-L-5-0/TR  [SOT-223-4_L6.5-W3.5-P2.30-LS7.0-BR]
sheet programing uMicrocontroller
C1  100nF  [C0603]
C2  1uF  [C0603]
C3  22pF  [C0603]
C4  22pF  [C0603]
C5  100nF  [C0603]
C6  100nF  [C0603]
D2  1N4148WS-HE3-18  [SOD-323F_L2.0-W1.6-LS2.5-RD]
H1  Header-Female-2.54_2x3  [HDR-TH_6P-P2.54-V-F-R2-C3-S2.54]
L1  BLM21PG300SN1D  [L0805]
LED1  HL-PSC-2012S31YC  [LED0805-RD_YELLOW]
LED2  HL-PSC-2012S31YC  [LED0805-RD_YELLOW]
R1  CG0603MLC-05E  [R0603]
R2  1MΩ  [R0603]
R5  1K  [R0603]
R7  22  [R0603]
R8  22  [R0603]
R9  CG0603MLC-05E  [R0603]
R10  1MΩ  [R0603]
R11  5.11K  [R0603]
R12  5.11K  [R0603]
R140  10K  [R0603]
RN1  1kΩ  [RES-ARRAY-SMD_1206-8P-L5.1-W3.1-BL]
U2  ATMEGA16U2-MU  [QFN-32_L5.0-W5.0-P0.50-BL-EP3.4]
U4  MF-MSMF050-2  [F1812]
U5  Solder Joint  [SOLDER-JOINT]
U45  Solder Joint  [SOLDER-JOINT]
USBC1  TYPE-C-31-M-12  [USB-C_SMD-TYPE-C-31-M-12]
X1  16MHz  [HC-49US_L11.5-W4.5-P4.88]
sheet SDCARD_sECTION
C20  100nF  [C0603]
C21  100nF  [C0603]
C22  100nF  [C0603]
CARD2  TF PUSH  [TF-SMD_TF-PUSH]
G_LED5  TJ-S1608SW6TGLC6B-A5  [LED0603-R-RD_BLUE]
R18  3.3K  [R0603]
R19  3.3K  [R0603]
R20  3.3K  [R0603]
R21  3.3K  [R0603]
R147  470  [R0603]
U9  AMS1117S-3.3  [SOT-89-3_L4.5-W2.5-P1.50-LS4.1-BR]
U11  SN74LVC125APWR  [TSSOP-14_L5.0-W4.4-P0.65-LS6.4-BL]
U12  Solder Joint  [SOLDER-JOINT]
U16  Solder Joint  [SOLDER-JOINT]

## Library data of the parts
C3 C4 C11 C19 C26 = AC0603JRNPO9BN220: Supplier: LCSC; Supplier Part: C309441; Manufacturer: YAGEO(国巨); Contributor: LCSC; JLCPCB Part Class: Extended Part
C1 C5-C7 C10 C12-C17 C20-C24 C27 = CL10B104KB8NNNC: Supplier: LCSC; Manufacturer: SAMSUNG(三星); Supplier Part: C1591; JLCPCB Part Class: Extended Part
C25 = TPSA106K010R0900: Supplier: LCSC; Supplier Part: C74423; Manufacturer: Kyocera AVX; Contributor: LCSC; JLCPCB Part Class: Extended Part
CAN_OUT1 = HDR-F-2.54_1x2: Supplier Part: C49661; Supplier: LCSC; Contributor: LCEDA_Lib
CAN_OUT2 = CONN-TH_2P-P5.00: Supplier: LCSC; Contributor: LCEDA_Lib
G_LED1-G_LED5 = TJ-S1608SW6TGLC6B-A5: Supplier: LCSC; Supplier Part: C192317; Manufacturer: TOGIALED(统佳); Contributor: LCSC; JLCPCB Part Class: Extended Part
R3 R5 R13 R22 R23 R26-R28 R33 R34 R41 R43 = AC0603FR-071KL: Supplier: LCSC; Manufacturer: YAGEO(国巨); Supplier Part: C116692; JLCPCB Part Class: Extended Part; Resistance: 1kΩ
R24 = RC0603JR-07120RL: Supplier: LCSC; Manufacturer: YAGEO(国巨); Supplier Part: C114681; JLCPCB Part Class: Extended Part; Resistance: 120Ω
R4 R14-R17 R25 R39 R45 R49 R138 R140 = AC0603FR-0710KL: Supplier: LCSC; Manufacturer: YAGEO(国巨); Supplier Part: C116677; JLCPCB Part Class: Extended Part; Resistance: 10kΩ
U13 = TJA1050T/CM,118: Supplier: LCSC; Manufacturer: NXP(恩智浦); Supplier Part: C6952; JLCPCB Part Class: Basic Part
U14 = MCP2515-I/ST: Supplier: LCSC; Manufacturer: MICROCHIP(美国微芯); Supplier Part: C15193; JLCPCB Part Class: Extended Part
U5 U12 U15-U17 U45 = Solder Joint: Contributor: alessioteti28
U54 = JUMPER2: Supplier: LCSC; Supplier Part: C2940092; Manufacturer: null; Manufacturer Part: Jumper2; Contributor: LCSC; JLCPCB Part Class: Extended Part
X3 = X49SD8MSD2SI: Supplier: LCSC; Supplier Part: C188204; Manufacturer: YXC(扬兴晶振); Contributor: LCSC; JLCPCB Part Class: Extended Part
Q2-Q5 Q22 Q28 = MMBT2222AT: Supplier: LCSC; Supplier Part: C190608; Manufacturer: CJ(江苏长电/长晶); Contributor: LCSC; JLCPCB Part Class: Extended Part
R29 R31 R35 R37 R122 R148 = 0603WAJ0103T5E: Supplier: LCSC; Manufacturer: UNI-ROYAL(厚声); Supplier Part: C15401; Resistance (Ohms): 10K; JLCPCB Part Class: Extended Part
R30 R32 R36 R38 R40 R120 R123 R145 = RMC04021.1K1%N: Supplier: LCSC; Supplier Part: C325543; Manufacturer: Tyohm(幸亚电阻); Resistance (Ohms): 1.1K; Contributor: LCSC; JLCPCB Part Class: Extended Part
R46 R50-R52 R139 R142 = RT0603BRD075K6L: Supplier: LCSC; Supplier Part: C179095; Manufacturer: YAGEO(国巨); Contributor: LCSC; JLCPCB Part Class: Extended Part; Resistance: 5.6kΩ
R_LED1-R_LED5 = HL-PST-1608S9AC: Supplier: LCSC; Supplier Part: C497932; Manufacturer: HONGLITRONIC(鸿利光电); Contributor: LCSC; JLCPCB Part Class: Extended Part
SJ1-SJ3 = SOLDERJUMPER_2WAY0603: Contributor: glennsky
Q7 Q26 Q27 = IRF540NSTRLPBF: Supplier: LCSC; Manufacturer: Infineon(英飞凌); Supplier Part: C23982; JLCPCB Part Class: Extended Part
R42 R47 R48 R137 R143 = AC1206JR-072K2L: Supplier: LCSC; Supplier Part: C229917; Manufacturer: YAGEO(国巨); Contributor: LCSC; JLCPCB Part Class: Extended Part; Resistance: 2.2kΩ
U3 U18 U19 = S2B-XH-A-(LF)(SN): Supplier: LCSC; Supplier Part: C157931; Manufacturer: JST; Manufacturer Part: S2B-XH-A(LF)(SN); Contributor: LCSC; JLCPCB Part Class: Extended Part
U20 U58 = CYPC817: Supplier: LCSC; Supplier Part: C385061; Manufacturer: OCIC; Contributor: LCSC; JLCPCB Part Class: Extended Part
C2 C18 = CC0603KRX5R8BB105: Supplier: LCSC; Manufacturer: YAGEO(国巨); Supplier Part: C14664; JLCPCB Part Class: Extended Part
CN2 = S10B-XH-A-1(LF)(SN): Supplier: LCSC; Supplier Part: C491718; Manufacturer: JST; Contributor: LCSC; JLCPCB Part Class: Extended Part
D2 D3 = 1N4148WS-HE3-18: Supplier: LCSC; Supplier Part: C448648; Manufacturer: VISHAY(威世); Contributor: LCSC; JLCPCB Part Class: Extended Part
DIGITAL_OUT I2C_OUT_1 I2C_OUT_2 PWM_OUT RX_TX_OUT U10 = S4B-XH-A-1-(LF)(SN): Supplier: LCSC; Supplier Part: C163037; Manufacturer: JST; Manufacturer Part: S4B-XH-A-1(LF)(SN); Contributor: LCSC; JLCPCB Part Class: Extended Part
H1 H2 = Header-Female-2.54_2x3: Supplier: LCSC; Manufacturer: CONNFLY; Manufacturer Part: DS1023-2*3SF11; Contributor: LCSC; Supplier Part: C92272; JLCPCB Part Class: Extended Part
H3-H6 = M3 HOLE PLATED: Contributor: Zdravko Kreže
L2 = SDFL2012S100KTF: Supplier: LCSC; Manufacturer: Sunlord(顺络); Supplier Part: C1046; JLCPCB Part Class: Basic Part
LED3 LED4 = SZYY0805YG: Supplier: LCSC; Supplier Part: C434435; Manufacturer: yongyu(永裕光电); Contributor: LCSC; JLCPCB Part Class: Extended Part
PB1 = 0946_TS42031-160W-TR-7260: Contributor: Rising Divergence
Q1 = IRLML6402TRPBF_C558180: Supplier: LCSC; Supplier Part: C558180; Manufacturer: VBsemi(微碧); Manufacturer Part: IRLML6402TRPBF-VB; Contributor: LCSC; JLCPCB Part Class: Extended Part
R2 R6 R10 = ETCR0603F1M00K9: Supplier: LCSC; Supplier Part: C365401; Manufacturer: RESI(开步睿思）; Resistance (Ohms): 1M; Contributor: LCSC; JLCPCB Part Class: Extended Part
R44 = NTCS0603E3103FLT: Supplier: LCSC; Manufacturer: VISHAY(威世); Contributor: LCSC; Supplier Part: C142556; JLCPCB Part Class: Extended Part
U1 = ATMEGA2560-16AU: Supplier: LCSC; Manufacturer: MICROCHIP(美国微芯); Supplier Part: C22460; JLCPCB Part Class: Extended Part
U7 = LP2985-33DBVR: Supplier: LCSC; Manufacturer: TI(德州仪器); Supplier Part: C95414; JLCPCB Part Class: Extended Part
U8 = LMV358SG-13: Supplier Part: C150507; Supplier: LCSC; Manufacturer: DIODES(美台); subpart_no: 1; JLCPCB Part Class: Extended Part
X2 = CSTCE16M0V53-R0: Supplier: LCSC; Manufacturer: muRata(村田); Supplier Part: C32180; JLCPCB Part Class: Extended Part
C8 C9 = RVE47UF25V67RV0069: Supplier: LCSC; Supplier Part: C2895268; Manufacturer: KNSCHA(科尼盛); Contributor: LCSC; JLCPCB Part Class: Extended Part
D4 = SS56_C698825: Supplier: LCSC; Supplier Part: C698825; Manufacturer: YANGJIE(扬杰); Manufacturer Part: SS56; Contributor: LCSC; JLCPCB Part Class: Extended Part
U6 = SPX1117M3-L-5-0/TR: Supplier: LCSC; Manufacturer: MaxLinear; Supplier Part: C21946; JLCPCB Part Class: Extended Part
L1 = BLM21PG300SN1D: Supplier: LCSC; Manufacturer: muRata(村田); Supplier Part: C16903; JLCPCB Part Class: Extended Part
LED1 LED2 = HL-PSC-2012S31YC: Supplier: LCSC; Supplier Part: C497956; Manufacturer: HONGLITRONIC(鸿利光电); Contributor: LCSC; JLCPCB Part Class: Extended Part
R1 R9 = CG0603MLC-05E: Supplier: LCSC; Supplier Part: C840634; Manufacturer: BOURNS; Contributor: LCSC; JLCPCB Part Class: Extended Part
R7 R8 = RC0603FR-0722RL: Supplier: LCSC; Manufacturer: YAGEO(国巨); Supplier Part: C107701; JLCPCB Part Class: Extended Part; Resistance: 22Ω
R11 R12 = AC0603FR-075K11L: Supplier: LCSC; Supplier Part: C227976; Manufacturer: YAGEO(国巨); Contributor: LCSC; JLCPCB Part Class: Extended Part; Resistance: 5.11kΩ
RN1 = CRA064RJ1KE04: Supplier: LCSC; Manufacturer: EVER OHMS(天二科技); Manufacturer Part: CRA064RJ1K00E04Z; Resistance (Ohms): 1K; Contributor: LCSC; Supplier Part: C149873; JLCPCB Part Class: Extended Part
U2 = ATMEGA16U2-MU: Supplier: LCSC; Manufacturer: MICROCHIP; Supplier Part: C17317; JLCPCB Part Class: Extended Part
U4 = MF-MSMF050-2: Supplier: LCSC; Manufacturer: BOURNS; Supplier Part: C17313; JLCPCB Part Class: Extended Part
USBC1 = TYPE-C-31-M-12: Supplier: LCSC; Supplier Part: C165948; Manufacturer: 韩国韩荣; Contributor: LCSC; JLCPCB Part Class: Extended Part
X1 = B16000J114: Supplier: LCSC; Supplier Part: C279575; Manufacturer: ECEC(东晶); Contributor: LCSC; JLCPCB Part Class: Extended Part
CARD2 = TF PUSH: Supplier: LCSC; Supplier Part: C393941; Manufacturer: SHOU HAN; Contributor: LCSC; JLCPCB Part Class: Extended Part
R18-R21 = RC0603JR-073K3L: Supplier: LCSC; Manufacturer: YAGEO(国巨); Supplier Part: C114432; JLCPCB Part Class: Extended Part; Resistance: 3.3kΩ
R147 = RC0603FR-07470RL: Supplier: LCSC; Manufacturer: YAGEO(国巨); Supplier Part: C114669; JLCPCB Part Class: Extended Part; Resistance: 470Ω
U9 = AMS1117S-3.3: Supplier: LCSC; Supplier Part: C917152; Manufacturer: JSMSEMI(杰盛微); Contributor: LCSC; JLCPCB Part Class: Extended Part
U11 = SN74LVC125APWR: Supplier: LCSC; Manufacturer: TI(德州仪器); Supplier Part: C7813; JLCPCB Part Class: Extended Part

## Nets
3.3V: C18.2 CN2.10 U7.5(VOUT) U8.2(VINA-)
3.3V_SD: C22.2 CARD2.4(VDD) R147.2 U9.2(VOUT) U11.14(VCC)
+5V: C5.2 C9.1 C13.1 C14.1 C15.1 C16.1 C17.2 CN2.1 D2.1(C) D3.1(C) H1.2 H2.2 I2C_OUT_1.4 I2C_OUT_2.4 L2.2 PWM_OUT.4 Q1.2(S) R3.2 R4.2 R14.2 R15.2 R22.1 R26.1 R27.1 R28.1 R33.1 R34.1 R44.2 R140.2 RN1.5 RN1.6 RX_TX_OUT.4 U1.10(VCC) U1.31(VCC) U1.61(VCC) U1.80(VCC) U2.4(VCC) U2.32(AVCC) U6.2(output) U6.4(output) U7.1(VIN) U7.3(ON/OFF#) U8.8(VDD) U12.2 U15.2
GND: C2.1 C3.1 C4.1 C5.1 C6.1 C7.2 C8.2 C9.2 C10.2 C11.2 C12.2 C13.2 C14.2 C15.2 C16.2 C17.1 C18.1 C19.2 C20.1 C21.1 C22.1 C23.1 C24.1 C25.2 C26.2 C27.2 CARD2.6(VSS) CARD2.10 CARD2.11 CARD2.12 CARD2.13 CN2.2 G_LED1.2(K) G_LED5.2(K) H1.6 H2.6 I2C_OUT_1.1 I2C_OUT_2.1 L1.2 LED3.2(-) LED4.2(-) PB1.1 PB1.2 PWM_OUT.1 Q2.2(E) Q3.2(E) Q4.2(E) Q5.2(E) Q7.3(S) Q22.2(E) Q26.3(S) Q27.3(S) Q28.2(E) R5.2 R11.2 R12.1 R16.1 R29.1 R31.1 R35.1 R37.1 R39.1 R45.1 R49.1 R122.1 R138.1 R148.1 R_LED4.1(-) R_LED5.1(-) RX_TX_OUT.1 U1.11(GND) U1.32(GND) U1.62(GND) U1.81(GND) U1.99(GND) U2.3(GND) U2.28(UGND) U2.33(EP) U3.1 U5.1 U5.2 U6.1(GND) U7.2(GND) U8.4(VSS) U9.1(GND) U11.1(1OE) U11.4(2OE) U11.7(GND) U11.10(3OE) U11.13(4OE) U13.2(GND) U13.8(S) U14.10(VSS) U18.2 U19.2 U20.2(CAT) U20.3(EM) U58.2(CAT) U58.3(EM) USBC1.A1(GND) USBC1.A12(GND) USBC1.B1(GND) USBC1.B12(GND) X2.2
ADC0: U1.97(PF0 (ADC0)) U10.4
ADC1: U1.96(PF1 (ADC1)) U10.3
ADC2: U1.95(PF2 (ADC2)) U10.2
ADC3: U1.94(PF3 (ADC3)) U10.1
ADC_4: R44.1 R49.2 U1.93(PF4 (ADC4TCK))
ARD_SHUTDOWN_SIG: R145.2 U1.39(PL4 (OC5B))
AREF: C10.1 U1.98(AREF)
CAN_H: CAN_OUT1.1 CAN_OUT2.1 U13.7(CANH) U54.1
CAN_L: CAN_OUT1.2 CAN_OUT2.2 R24.1 U13.6(CANL)
CAN_RX: U13.4(RXD) U14.2(RXCAN)
CAN_TX: U13.1(TXD) U14.1(TXCAN)
CAN_VCC: C23.2 C24.2 C25.1 R23.2 R25.2 U13.3(VCC) U14.20(VDD) U15.1
COM_IND_LEDS: R38.2 U1.38(PL3 (OC5A))
COMP: C27.1 R16.2 R17.1 U8.3(VINA+)
CS_LLS: CARD2.2(CD/DAT3) U11.8(3Y)
D0_LLS: CARD2.7(DAT0) R20.2
D+: R1.2 R8.1 USBC1.A6(DP1) USBC1.B6(DP2)
D-: R7.1 R9.2 USBC1.A7(DN1) USBC1.B7(DN2)
DI_LLS: CARD2.3(CMD) U11.3(1Y)
DIG_OUT_1: DIGITAL_OUT.4 U1.78(PA0 (AD0))
DIG_OUT_2: DIGITAL_OUT.3 U1.77(PA1 (AD1))
DIG_OUT_3: DIGITAL_OUT.2 U1.76(PA2 (AD2))
DIG_OUT_4: DIGITAL_OUT.1 U1.75(PA3 (AD3))
FAN_SIG: R40.2 U1.40(PL5 (OC5C))
INT_MCP: U1.35(PL0 (ICP4)) U14.13(INT#)
LV_12V: C7.1 C8.1 D4.1(K) R17.2 R42.2 R47.2 R137.2 R142.1 R143.2 U6.3(input)
LV_FAN_SIG: Q7.4(D) R41.1 R42.1 U19.1
LV_SHUTDOWN_SIG: Q27.4(D) R43.1 R143.1 U18.1
M8RXD: RN1.2 U2.9(PD3 (TXD1/INT3))
M8TXD: RN1.1 U2.8(PD2 (RXD1/AIN1/INT2))
MISO1: CN2.3 H2.1 U1.22(PB3 (MISOPCINT3)) U11.11(4Y) U14.17(SO)
MISO2: H1.1 U2.17(PB3 (PDO/MISO/PCINT3))
MOSI1: CN2.4 H2.4 R18.1 U1.21(PB2 (MOSIPCINT2)) U14.16(SI)
MOSI2: H1.4 U2.16(PB2 (PDI/MOSI/PCINT2))
PB1: CN2.5 H2.3 R19.1 U1.20(PB1 (SCKPCINT1)) U14.14(SCK)
PE_0: RN1.7 U1.2(PE0 (RXD0PCINT8))
PE_1: RN1.8 U1.3(PE1 (TXD0))
PIN_PWM1: PWM_OUT.2 U1.6(PE4 (OC3BINT4))
PIN_PWM2: PWM_OUT.3 U1.7(PE5 (OC3CINT5))
RD+: R8.2 U2.29(D+)
RD-: R7.2 U2.30(D-)
RESET: C1.2 C11.1 D3.2(A) H2.5 PB1.3 PB1.4 R4.1 U1.30(RESET#) U45.1 U45.2
RESET2: D2.2(A) H1.5 R140.1 U2.24(Reset#(PC1/dW))
RX_1: RX_TX_OUT.2 U1.45(PD2 (RXD1INT2))
RX_L: LED2.1 U2.10(PD4 (INT5/AIN3))
SCK2: H1.3 U2.15(PB1 (SCLK/PCINT1))
SCK_LLS: CARD2.5(CLX) U11.6(2Y)
SCL: I2C_OUT_1.3 I2C_OUT_2.3 R15.1 U1.43(PD0 (SCLINT0))
SDA: I2C_OUT_1.2 I2C_OUT_2.2 R14.1 U1.44(PD1 (SDAINT1))
SS_1: U1.19(PB0 (SS#PCINT0)) U16.1
SS_2: CN2.6 U1.23(PB4 (OC2APCINT4))
SS_3: CN2.7 U1.24(PB5 (OC1APCINT5))
SS_4: CN2.8 U1.25(PB6 (OC1BPCINT6))
SS_5: CN2.9 U1.15(PH3 (OC4A))
SS_6: U1.16(PH4 (OC4B)) U17.1
T_IND_LEDS: R32.2 U1.37(PL2 (T5))
TX_1: RX_TX_OUT.3 U1.46(PD3 (TXD1INT3))
TX_L: LED1.1 U2.11(PD5 (XCK/AIN4/PCINT12))
USB_POUT: U4.1 USBC1.A4(VBUS) USBC1.A9(VBUS) USBC1.B4(VBUS) USBC1.B9(VBUS)
USB_SHIELD: R10.2 USBC1.0(SH) USBC1.1(SH) USBC1.2(SH) USBC1.3(SH)
USBVCC: C6.2 Q1.3(D) U2.31(UVCC) U4.2
V_IND_LEDS: R120.2 U1.36(PL1 (ICP5))
Net-(C1-1): C1.1 R5.1 U2.13(PD7 (CTS#/HWB#/AIN6/T0/INT7))
Net-(C2-2): C2.2 U2.27(UCAP)
Net-(C3-2): C3.2 R2.1 U2.2((PC0) XTAL2) X1.1(OSC1)
Net-(C4-2): C4.2 R2.2 U2.1(XTAL1) X1.2(OSC2)
Net-(C12-1): C12.1 L2.1 U1.100(AVCC)
Net-(C19-1): C19.1 U14.8(OSC2) X3.1(OSC1)
Net-(C20-2): C20.2 C21.2 U9.3(VIN) U12.1
Net-(C26-1): C26.1 U14.9(OSC1) X3.2(OSC2)
Net-(D4-2): D4.2(A) U3.2
Net-(G_LED1-1): G_LED1.1(A) R23.1
Net-(G_LED2-1): G_LED2.1(A) R22.2
Net-(G_LED2-2): G_LED2.2(K) Q28.3(C)
Net-(G_LED3-1): G_LED3.1(A) R28.2
Net-(G_LED3-2): G_LED3.2(K) Q2.3(C)
Net-(G_LED4-1): G_LED4.1(A) R34.2
Net-(G_LED4-2): G_LED4.2(K) Q4.3(C)
Net-(G_LED5-1): G_LED5.1(A) R147.1
Net-(L1-1): L1.1 R1.1 R9.1 R10.1
Net-(LED1-2): LED1.2 RN1.4
Net-(LED2-2): LED2.2 RN1.3
Net-(LED3-1): LED3.1(+) R3.1
Net-(LED4-1): LED4.1(+) R13.1
Net-(Q1-1): Q1.1(G) U8.1(VOUTA)
Net-(Q2-1): Q2.1(B) R29.2 R30.1 R51.2
Net-(Q3-1): Q3.1(B) R31.2 R32.1
Net-(Q3-3): Q3.3(C) R_LED2.1(-) SJ2.2
Net-(Q4-1): Q4.1(B) R35.2 R36.1 R52.2
Net-(Q5-1): Q5.1(B) R37.2 R38.1
Net-(Q5-3): Q5.3(C) R_LED3.1(-) SJ3.2
Net-(Q7-1): Q7.1(G) R45.2 R46.1
Net-(Q22-1): Q22.1(B) R120.1 R122.2
Net-(Q22-3): Q22.3(C) R_LED1.1(-) SJ1.2
Net-(Q26-1): Q26.1(G) R138.2 R139.1
Net-(Q26-4): Q26.4(D) R48.2 R142.2
Net-(Q27-1): Q27.1(G) R39.2 R48.1
Net-(Q28-1): Q28.1(B) R50.2 R123.1 R148.2
Net-(R6-1): R6.1 U1.33(XTAL2) X2.3
Net-(R6-2): R6.2 U1.34(XTAL1) X2.1
Net-(R11-1): R11.1 USBC1.A5(CC1)
Net-(R12-2): R12.2 USBC1.B5(CC2)
Net-(R13-2): R13.2 U8.6(VINB-) U8.7(VOUTB)
Net-(R18-2): R18.2 U11.2(1A)
Net-(R19-2): R19.2 U11.5(2A)
Net-(R20-1): R20.1 U11.12(4A)
Net-(R21-1): R21.1 U11.9(3A)
Net-(R21-2): R21.2 U16.2
Net-(R24-2): R24.2 U54.2
Net-(R25-1): R25.1 U14.19(RESET#)
Net-(R26-2): R26.2 R_LED1.2(+)
Net-(R27-2): R27.2 R_LED2.2(+)
Net-(R30-2): R30.2 SJ2.3
Net-(R33-2): R33.2 R_LED3.2(+)
Net-(R36-2): R36.2 SJ3.3
Net-(R40-1): R40.1 U20.1(AN)
Net-(R41-2): R41.2 R_LED4.2(+)
Net-(R43-2): R43.2 R_LED5.2(+)
Net-(R46-2): R46.2 R47.1 U20.4(COL)
Net-(R50-1): R50.1 SJ1.1
Net-(R51-1): R51.1 SJ2.1
Net-(R52-1): R52.1 SJ3.1
Net-(R123-2): R123.2 SJ1.3
Net-(R137-1): R137.1 R139.2 U58.4(COL)
Net-(R145-1): R145.1 U58.1(AN)
Net-(U1-26): U1.26(PB7 (OC0AOC1CPCINT7)) U8.5(VINB+)
Net-(U14-18): U14.18(CS#) U17.2

Not connected (* = marked no-connect by the designer): CARD2 1(DAT2)* 8(DAT1)* CD*; H3 1*; H4 1*; H5 1*; H6 1*; PB1 5(5-GND)*; U1 1(PG5 (OC0B))* 4(PE2 (XCK0AIN0))* 5(PE3 (OC3AAIN1))* 8(PE6 (T3INT6))* 9(PE7 (CLKOICP3INT7))* 12(PH0 (RXD2))* 13(PH1 (TXD2))* 14(PH2 (XCK2))* 17(PH5 (OC4C))* 18(PH6 (OC2B))* 27(PH7 (T4))* 28(PG3 (TOSC2))* 29(PG4 (TOSC1))* 41(PL6)* 42(PL7)* 47(PD4 (ICP1))* 48(PD5 (XCK1))* 49(PD6 (T1))* 50(PD7 (T0))* 51(PG0 (WR#))* 52(PG1 (RD#))* 53(PC0 (A8))* 54(PC1 (A9))* 55(PC2 (A10))* 56(PC3 (A11))* 57(PC4 (A12))* 58(PC5 (A13))* 59(PC6 (A14))* 60(PC7 (A15))* 63(PJ0 (RXD3PCINT9))* 64(PJ1 (TXD3PCINT10))* 65(PJ2 (XCK3PCINT11))* 66(PJ3 (PCINT12))* 67(PJ4 (PCINT13))* 68(PJ5 (PCINT14))* 69(PJ6 (PCINT15))* 70(PG2 (ALE))* 71(PA7 (AD7))* 72(PA6 (AD6))* 73(PA5 (AD5))* 74(PA4 (AD4))* 79(PJ7)* 82(PK7 (ADC15PCINT23))* 83(PK6 (ADC14PCINT22))* 84(PK5 (ADC13PCINT21))* 85(PK4 (ADC12PCINT20))* 86(PK3 (ADC11PCINT19))* 87(PK2 (ADC10PCINT18))* 88(PK1 (ADC9PCINT17))* 89(PK0 (ADC8PCINT16))* 90(PF7 (ADC7TDI))* 91(PF6 (ADC6TDO))* 92(PF5 (ADC5TMS))*; U2 5(PC2 (PCINT11/AIN2))* 6(PD0 (OC.0B/INT0))* 7(PD1 (AIN0/INT1))* 12(PD6 (RTS#/AIN5/INT6))* 14(PB0 (SS#/PCINT0))* 18(PB4 (T1/PCINT4))* 19(PB5 (PCINT5))* 20(PB6 (PCINT6))* 21(PB7 (PCINT7/OC.0A/OC.1C))* 22(PC7 (INT4/ICP1/CLKO))* 23(PC6 (OC.1A/PCINT8))* 25(PC5 (PCINT9/OC.1B))* 26(PC4 (PCINT10))*; U7 4(BYPASS)*; U13 5(VREF)*; U14 3(CLKOUTSOF)* 4(TX0RTS#)* 5(TX1RTS#)* 6(NC)* 7(TX2RTS#)* 11(RX1BF#)* 12(RX0BF#)* 15(NC/2)*; USBC1 A8(SBU1)* B8(SBU2)*

## Notes on the sheets
sheet 1
- BLOCK DIAGRAM
- SD CARD
- BUFFER IC
- CONNECTOR
- LVS0505S
- V REG 3.3
- voltage Regulator
- REVERSE POLARITY
- 12v
- SHUT ERR
- L117 SOMETHIN
- PROTECTION
- GND
- 5V
- SHUTDOWN ERR
- CIRCUIT
- THERMAL SHUT
- i2C COMM
- ATMEL
- ISOLATED
- SERIAL COM IC
- USB PROTECTION
- C-TYPE
- Atmega 2560
- STATUS LEDS
- FAN CONN
- FAN CIRCUIT LOGIC
- CIRCUIT
- CAN CONTROLLER
- i2C
- SPI CONN
- CAN  IC
- PWM
- D I/O
- A I/O
- H
- L
- CAN CONNECTOR
sheet 2
- TEMP
sheet 4
- POWER SECTION
- POWER ON LED
sheet 5
- LV-SHUTDOWN SIGNAL SECTION
- shutdown signal section
- 0  = OK
- 1
- 1
- 0
- LED => BMS ERROR
- 1 = ON _SIGNAL
- 0
- 1
- LED => FAN_ON
sheet 6
- 0
- 0
- 1
- 1
- 0
- 1
- STATUS LEDS (V,T,I2C/COM)(G=OK, r=ABNORMAL);
sheet 7
- CAN_BUS SECTION:
sheet 8
- SD-CARD SECTION:
